# EAGLE design robot (EAGLE 6.5.0)
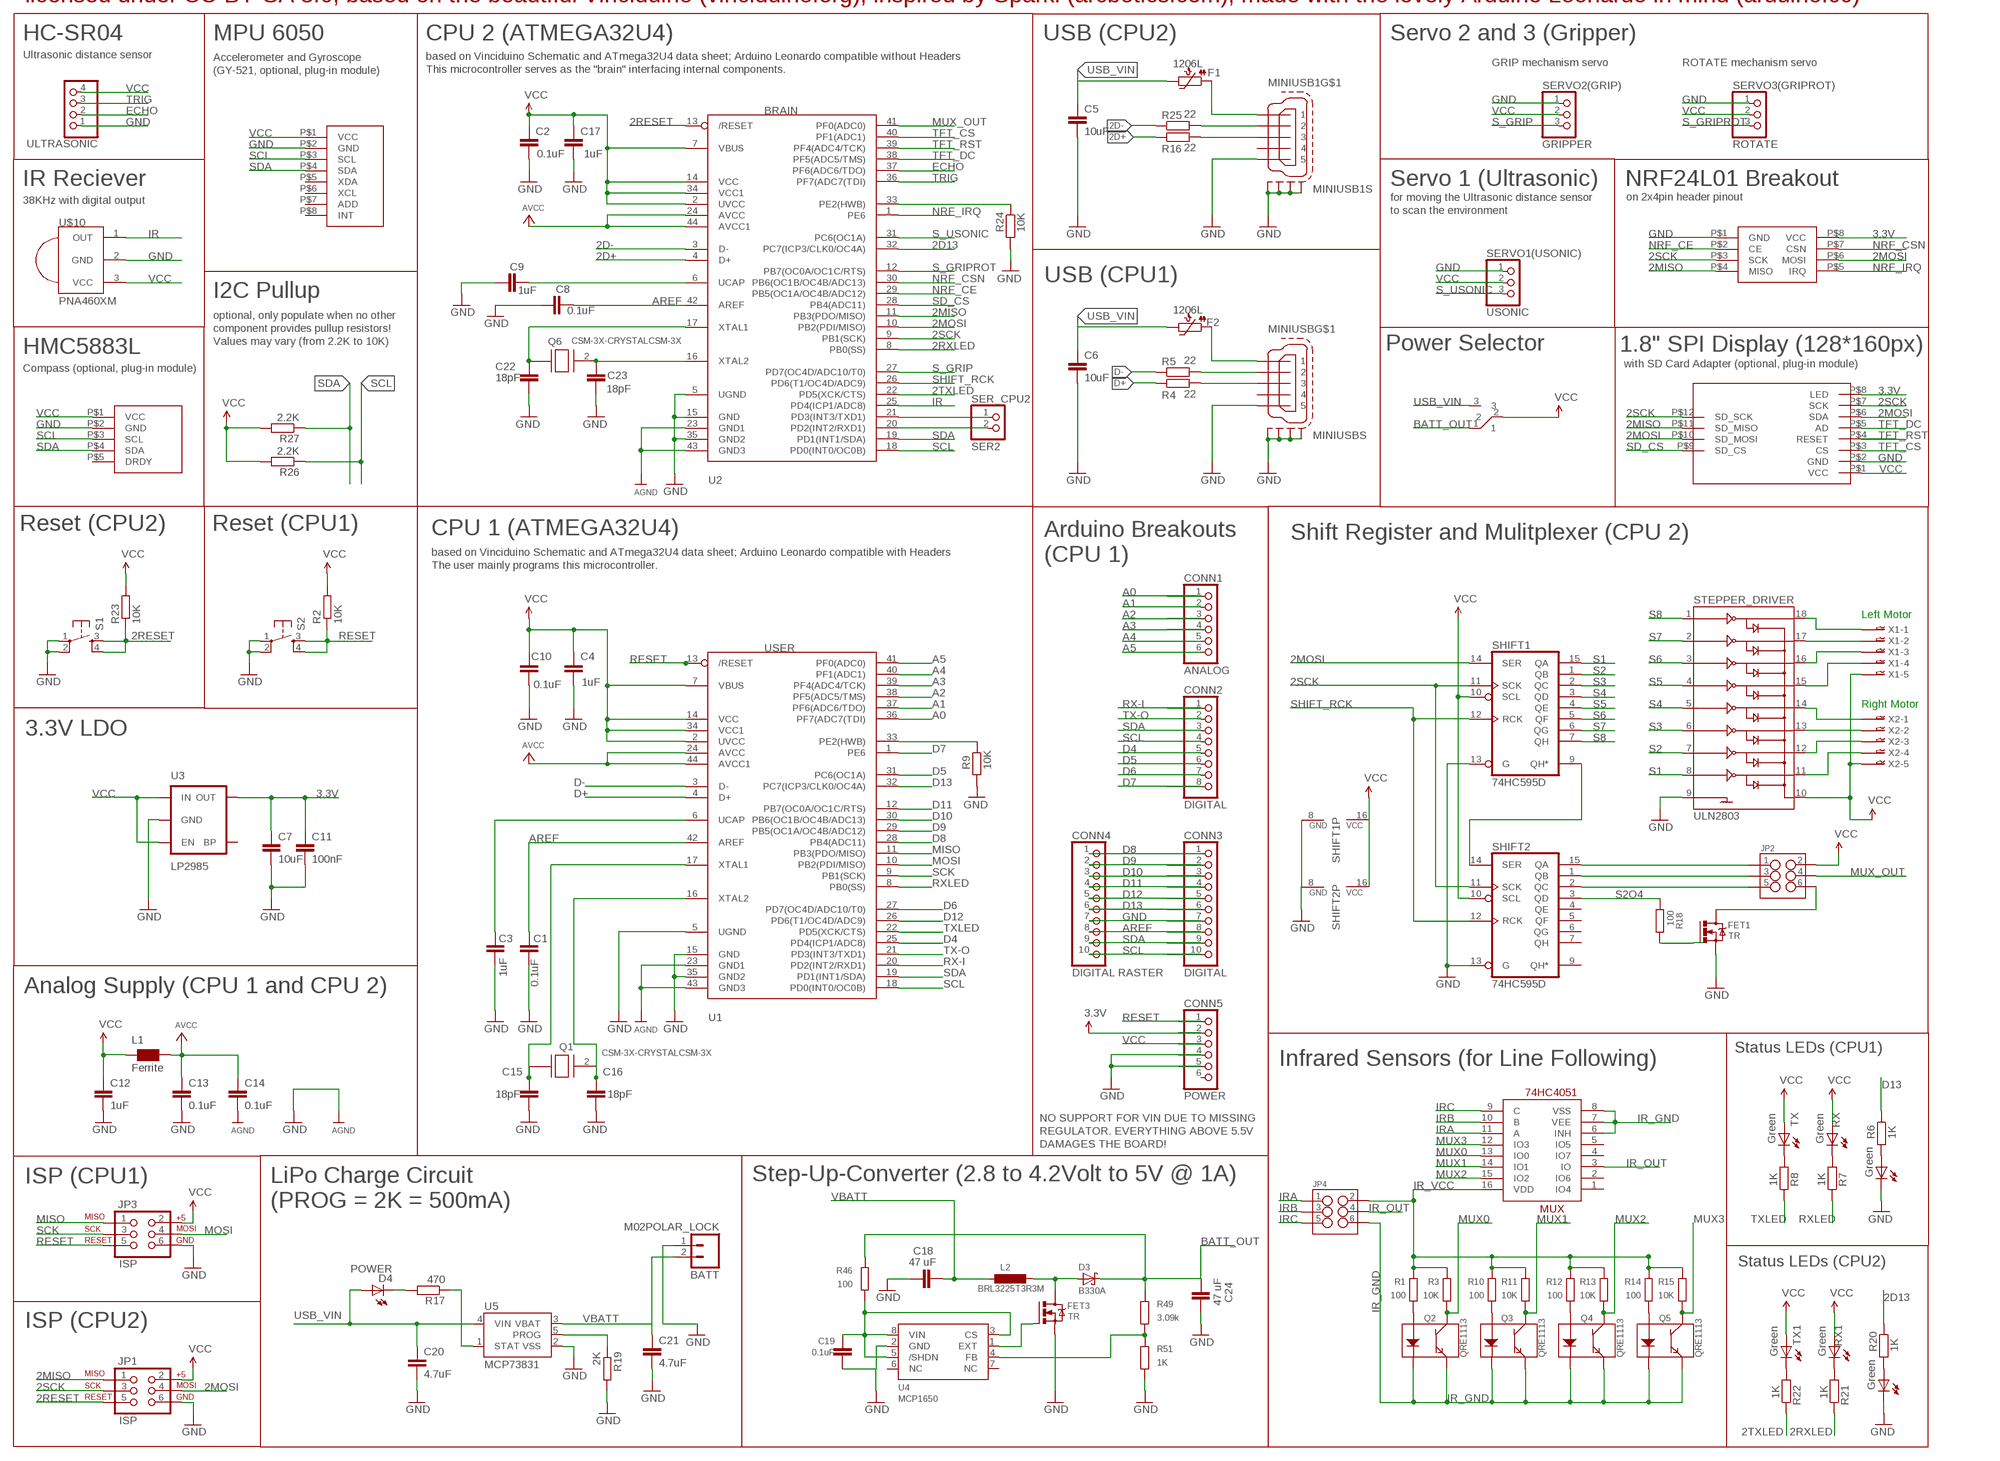
[diagram p0: schematic, sheet 1]

## Parts
BATT  M02POLAR_LOCK  [MOLEX-1X2_LOCK]
C1  0.1uF  C-EUC1206  [C1206]
C2  0.1uF  C-EUC1206  [C1206]
C3  1uF  C-EUC1206  [C1206]
C4  1uF  C-EUC1206  [C1206]
C5  10uF  C-EUC1206  [C1206]
C6  10uF  C-EUC1206  [C1206]
C7  10uF  C-EUC1206  [C1206]
C8  0.1uF  C-EUC1206  [C1206]
C9  1uF  C-EUC1206  [C1206]
C10  0.1uF  C-EUC1206  [C1206]
C11  100nF  C-EUC1206  [C1206]
C12  1uF  C-EUC1206  [C1206]
C13  0.1uF  C-EUC1206  [C1206]
C14  0.1uF  C-EUC1206  [C1206]
C15  18pF  C-EUC1206  [C1206]
C16  18pF  C-EUC1206  [C1206]
C17  1uF  C-EUC1206  [C1206]
C18  47 uF  C-EUC1206  [C1206]
C19  0.1uF  C-EUC1206  [C1206]
C20  4.7uF  C-EUC1206  [C1206]
C21  4.7uF  C-EUC1206  [C1206]
C22  18pF  C-EUC1206  [C1206]
C23  18pF  C-EUC1206  [C1206]
C24  47 uF  C-EUC1206  [C1206]
CONN1  ANALOG  PINHD-1X6B  [1X06-BIG]
CONN2  DIGITAL  PINHD-1X8BIG  [1X08-BIG]
CONN3  DIGITAL  PINHD-1X10  [1X10-BIG]
CONN4  DIGITAL RASTER  PINHD-1X10  [1X10-BIG]
CONN5  POWER  PINHD-1X6B  [1X06-BIG]
D3  B330A  [SMA]
D4  POWER  LED1206  [LED-1206]
D13  Green  LED1206  [LED-1206]
D13_2  Green  LED1206  [LED-1206]
F1  1206L  PTC1206_L  [1206_PTC]
F2  1206L  PTC1206_L  [1206_PTC]
FET1  TR  IRLML2502TR  [MICRO3]
FET3  TR  IRLML2502TR  [MICRO3]
JP1  ISP  AVR_SPI_PRG_6PTH  [2X3]
JP2  M03X22X3_SILK_SM  [2X3]
JP3  ISP  AVR_SPI_PRG_6PTH  [2X3]
JP4  M03X22X3_SILK_SM  [2X3]
L1  Ferrite  WE-CBF_1206W  [1206W]
L2  BRL3225T3R3M  L-EUL3225P  [L3225P]
MINIUSB  MINI-USB-SCHIELD-32005-201  [32005-201]
MINIUSB1  MINI-USB-SCHIELD-32005-201  [32005-201]
MUX  74HC4051  74HC4051_MUX  [SO16]
Q1  CSM-3X-CRYSTALCSM-3X  [CSM-3X]
Q2  QRE1113  [QRE1113]
Q3  QRE1113  [QRE1113]
Q4  QRE1113  [QRE1113]
Q5  QRE1113  [QRE1113]
Q6  CSM-3X-CRYSTALCSM-3X  [CSM-3X]
R1  100  R-EU_R1206  [R1206]
R2  10K  R-EU_R1206  [R1206]
R3  10K  R-EU_R1206  [R1206]
R4  22  R-EU_R1206  [R1206]
R5  22  R-EU_R1206  [R1206]
R6  1K  R-EU_R1206  [R1206]
R7  1K  R-EU_R1206  [R1206]
R8  1K  R-EU_R1206  [R1206]
R9  10K  R-EU_R1206  [R1206]
R10  100  R-EU_R1206  [R1206]
R11  10K  R-EU_R1206  [R1206]
R12  100  R-EU_R1206  [R1206]
R13  10K  R-EU_R1206  [R1206]
R14  100  R-EU_R1206  [R1206]
R15  10K  R-EU_R1206  [R1206]
R16  22  R-EU_R1206  [R1206]
R17  470  R-EU_R1206  [R1206]
R18  100  R-EU_R1206  [R1206]
R19  2K  R-EU_R1206  [R1206]
R20  1K  R-EU_R1206  [R1206]
R21  1K  R-EU_R1206  [R1206]
R22  1K  R-EU_R1206  [R1206]
R23  10K  R-EU_R1206  [R1206]
R24  10K  R-EU_R1206  [R1206]
R25  22  R-EU_R1206  [R1206]
R26  2.2K  R-EU_R1206  [R1206]
R27  2.2K  R-EU_R1206  [R1206]
R46  100  R-EU_R1206  [R1206]
R49  3.09k  R-EU_R1206  [R1206]
R51  1K  R-EU_R1206  [R1206]
RX  Green  LED1206  [LED-1206]
RX1  Green  LED1206  [LED-1206]
S1  Reset  TAC_SWITCHSMD  [TACTILE_SWITCH_SMD]
S2  Reset  TAC_SWITCHSMD  [TACTILE_SWITCH_SMD]
SER_CPU2  SER2  PINHD-1X2  [1X02]
SERVO1(USONIC)  USONIC  PINHD-1X3  [1X03]
SERVO2(GRIP)  GRIPPER  PINHD-1X3  [1X03]
SERVO3(GRIPROT)  ROTATE  PINHD-1X3  [1X03]
SHIFT1  74HC595D  [SO16]
SHIFT2  74HC595D  [SO16]
STEPPER_DRIVER  ULN2803  ULN2803SOICW  [SO18L]
SW1  SPDT  [SPDT-PTH]
TX  Green  LED1206  [LED-1206]
TX1  Green  LED1206  [LED-1206]
U1  USER  ATMEGA32U4-AU  [TQFP44]
U2  BRAIN  ATMEGA32U4-AU  [TQFP44]
U3  LP2985  V_REG_LDOSMD  [SOT23-5@1]
U4  MCP1650  [MSOP8]
U5  MCP73831  MCP73831SMD  [SOT23-5]
U$2  1.8TFT+SD  [1.8TFTSD]
U$3  GY-521  [GY-521]
U$4  HMC5883L  [HMC5883L]
U$5  NRF24L01+  [NRF24L01+]
U$10  PNA460XM  [PNA460XM]
ULTRASONIC  PINHD-1X4  [1X04]
X1  05-JST-B5B-XH-A  [B5B-XH]
X2  05-JST-B5B-XH-A  [B5B-XH]

## Nets
2D13: R20.1 U2.32(PC7(ICP3/CLK0/OC4A))
2D+: R16.1 U2.4(D+)
2D-: R25.1 U2.3(D-)
2MISO: JP1.1 U2.11(PB3(PDO/MISO)) U$2.P$11(SD_MISO) U$5.P$4(MISO)
2MOSI: JP1.4 SHIFT1.14(SER) U2.10(PB2(PDI/MISO)) U$2.P$6(SDA) U$2.P$10(SD_MOSI) U$5.P$6(MOSI)
2RESET: JP1.5 R23.1 S1.3 S1.4 U2.13(/RESET)
2RXLED: R21.1 U2.8(PB0(SS))
2SCK: JP1.3 SHIFT1.11(SCK) SHIFT2.11(SCK) U2.9(PB1(SCK)) U$2.P$7(SCK) U$2.P$12(SD_SCK) U$5.P$3(SCK)
2TXLED: R22.1 U2.22(PD5(XCK/CTS))
2XTAL1: C22.1 Q6.1 U2.17(XTAL1)
2XTAL2: C23.1 Q6.2 U2.16(XTAL2)
3.3V: C7.1 C11.1 CONN5.2 U3.5(OUT) U$2.P$8(LED) U$5.P$8(VCC)
A0: CONN1.1 U1.36(PF7(ADC7(TDI))
A1: CONN1.2 U1.37(PF6(ADC6/TDO))
A2: CONN1.3 U1.38(PF5(ADC5/TMS))
A3: CONN1.4 U1.39(PF4(ADC4/TCK))
A4: CONN1.5 U1.40(PF1(ADC1))
A5: CONN1.6 U1.41(PF0(ADC0))
AREF: C1.2 C8.2 CONN3.8 CONN4.8 U1.42(AREF) U2.42(AREF)
AVCC: C13.1 C14.1 L1.2 U1.24(AVCC) U1.44(AVCC1) U2.24(AVCC) U2.44(AVCC1)
BATT_OUT: C24.1 D3.C R46.2 R49.2 SW1.1
D4: CONN2.5 U1.25(PD4(ICP1/ADC8))
D5: CONN2.6 U1.31(PC6(OC1A))
D6: CONN2.7 U1.27(PD7(OC4D/ADC10/T0))
D7: CONN2.8 U1.1(PE6)
D8: CONN3.1 CONN4.1 U1.28(PB4(ADC11))
D9: CONN3.2 CONN4.2 U1.29(PB5(OC1A/OC4B/ADC12))
D10: CONN3.3 CONN4.3 U1.30(PB6(OC1B/OC4B/ADC13))
D11: CONN3.4 CONN4.4 U1.12(PB7(OC0A/OC1C/RTS))
D12: CONN3.5 CONN4.5 U1.26(PD6(T1/OC4D/ADC9))
D13: CONN3.6 CONN4.6 R6.1 U1.32(PC7(ICP3/CLK0/OC4A))
D+: R4.1 U1.4(D+)
D-: R5.1 U1.3(D-)
ECHO: U2.37(PF6(ADC6/TDO)) ULTRASONIC.2
GND: BATT.1 C1.1 C2.2 C3.2 C4.2 C5.2 C6.2 C7.2 C8.1 C9.2 C10.2 C11.2 C12.2 C13.2 C14.2 C15.2 C16.2 C17.2 C18.1 C19.2 C20.2 C21.2 C22.2 C23.2 C24.2 CONN3.7 CONN4.7 CONN5.4 CONN5.5 D13.C D13_2.C FET1.2(S) FET3.2(S) JP1.6 JP3.6 MINIUSB1.5 MINIUSB1.M1(S:S1) MINIUSB1.M2(S:S2) MINIUSB1.M3(S:S3) MINIUSB1.M4(S:S4) MINIUSB.5 MINIUSB.M1(S:S1) MINIUSB.M2(S:S2) MINIUSB.M3(S:S3) MINIUSB.M4(S:S4) R9.2 R19.2 R24.2 R51.1 S1.1 S1.2 S2.1 S2.2 SERVO1(USONIC).1 SERVO2(GRIP).1 SERVO3(GRIPROT).1 SHIFT1.8(GND) SHIFT1.13(G) SHIFT2.8(GND) SHIFT2.13(G) STEPPER_DRIVER.9 U1.5(UGND) U1.15(GND) U1.23(GND1) U1.35(GND2) U1.43(GND3) U2.5(UGND) U2.15(GND) U2.23(GND1) U2.35(GND2) U2.43(GND3) U3.2(GND) U4.2(GND) U5.2(VSS) U$2.P$2(GND) U$3.P$2(GND) U$4.P$2(GND) U$5.P$1(GND) U$10.2(GND) ULTRASONIC.1 ; supply symbol labelled AGND
IR: U2.25(PD4(ICP1/ADC8)) U$10.1(OUT)
IR_GND: JP4.6 MUX.6(INH) MUX.7(VEE) MUX.8(VSS) Q2.2(K) Q2.4(E) Q3.2(K) Q3.4(E) Q4.2(K) Q4.4(E) Q5.2(K) Q5.4(E)
IR_OUT: JP4.4 MUX.3(IO)
IR_VCC: JP4.2 MUX.16(VDD) R1.2 R3.2 R10.2 R11.2 R12.2 R13.2 R14.2 R15.2
IRA: JP4.1 MUX.11(A)
IRB: JP4.3 MUX.10(B)
IRC: JP4.5 MUX.9(C)
MISO: JP3.1 U1.11(PB3(PDO/MISO))
MOSI: JP3.4 U1.10(PB2(PDI/MISO))
MUX0: MUX.13(IO0) Q2.3(C) R3.1
MUX1: MUX.14(IO1) Q3.3(C) R11.1
MUX2: MUX.15(IO2) Q4.3(C) R13.1
MUX3: MUX.12(IO3) Q5.3(C) R15.1
MUX_OUT: JP2.4 U2.41(PF0(ADC0))
N$1: R8.2 TX.C
N$2: MINIUSB.2 R5.2
N$3: SER_CPU2.1 U2.21(PD3(INT3/TXD1))
N$4: SER_CPU2.2 U2.20(PD2(INT2/RXD1))
N$5: MINIUSB.3 R4.2
N$6: R9.1 U1.33(PE2(HWB))
N$7: D13.A R6.2
N$8: C9.1 U2.6(UCAP)
N$9: R7.2 RX.C
N$10: Q2.1(A) R1.1
N$11: Q3.1(A) R10.1
N$12: Q4.1(A) R12.1
N$13: F2.1 MINIUSB.1
N$14: Q5.1(A) R14.1
N$15: C3.1 U1.6(UCAP)
N$16: FET1.1(G) R18.2
N$17: R24.1 U2.33(PE2(HWB))
N$18: F1.1 MINIUSB1.1
N$19: FET3.1(G) U4.1(EXT)
N$20: R19.1 U5.5(PROG)
N$21: R17.1 U5.1(STAT)
N$22: D4.C R17.2
N$23: R49.1 R51.2 U4.4(FB)
N$24: D3.A FET3.3(D) L2.2
N$25: C19.1 R46.1 U4.3(CS) U4.5(/SHDN) U4.8(VIN)
N$26: STEPPER_DRIVER.11 X2.P$4
N$27: STEPPER_DRIVER.12 X2.P$3
N$28: STEPPER_DRIVER.13 X2.P$2
N$29: STEPPER_DRIVER.14 X2.P$1
N$30: STEPPER_DRIVER.15 X1.P$4
N$31: STEPPER_DRIVER.16 X1.P$3
N$32: STEPPER_DRIVER.17 X1.P$2
N$33: STEPPER_DRIVER.18 X1.P$1
N$34: D13_2.A R20.2
N$35: R22.2 TX1.C
N$36: R21.2 RX1.C
N$37: MINIUSB1.2 R25.2
N$38: MINIUSB1.3 R16.2
N$41: JP2.1 SHIFT2.15(QA)
N$42: JP2.3 SHIFT2.1(QB)
N$43: JP2.5 SHIFT2.2(QC)
N$45: FET1.3(D) JP2.6
NRF_CE: U2.29(PB5(OC1A/OC4B/ADC12)) U$5.P$2(CE)
NRF_CSN: U2.30(PB6(OC1B/OC4B/ADC13)) U$5.P$7(CSN)
NRF_IRQ: U2.1(PE6) U$5.P$5(IRQ)
RESET: CONN5.1 JP3.5 R2.1 S2.3 S2.4 U1.13(/RESET)
RX-I: CONN2.1 U1.20(PD2(INT2/RXD1))
RXLED: R7.1 U1.8(PB0(SS))
S1: SHIFT1.15(QA) STEPPER_DRIVER.8
S1OVERFLOW: SHIFT1.9(QH*) SHIFT2.14(SER)
S2: SHIFT1.1(QB) STEPPER_DRIVER.7
S2O4: R18.1 SHIFT2.3(QD)
S3: SHIFT1.2(QC) STEPPER_DRIVER.6
S4: SHIFT1.3(QD) STEPPER_DRIVER.5
S5: SHIFT1.4(QE) STEPPER_DRIVER.4
S6: SHIFT1.5(QF) STEPPER_DRIVER.3
S7: SHIFT1.6(QG) STEPPER_DRIVER.2
S8: SHIFT1.7(QH) STEPPER_DRIVER.1
S_GRIP: SERVO2(GRIP).3 U2.27(PD7(OC4D/ADC10/T0))
S_GRIPROT: SERVO3(GRIPROT).3 U2.12(PB7(OC0A/OC1C/RTS))
S_USONIC: SERVO1(USONIC).3 U2.31(PC6(OC1A))
SCK: JP3.3 U1.9(PB1(SCK))
SCL: CONN2.4 CONN3.10 CONN4.10 R26.1 U1.18(PD0(INT0/OC0B)) U2.18(PD0(INT0/OC0B)) U$3.P$3(SCL) U$4.P$3(SCL)
SD_CS: U2.28(PB4(ADC11)) U$2.P$9(SD_CS)
SDA: CONN2.3 CONN3.9 CONN4.9 R27.1 U1.19(PD1(INT1/SDA)) U2.19(PD1(INT1/SDA)) U$3.P$4(SDA) U$4.P$4(SDA)
SHIFT_RCK: SHIFT1.12(RCK) SHIFT2.12(RCK) U2.26(PD6(T1/OC4D/ADC9))
TFT_CS: U2.40(PF1(ADC1)) U$2.P$3(CS)
TFT_DC: U2.38(PF5(ADC5/TMS)) U$2.P$5(AD)
TFT_RST: U2.39(PF4(ADC4/TCK)) U$2.P$4(RESET)
TRIG: U2.36(PF7(ADC7(TDI)) ULTRASONIC.3
TX-O: CONN2.2 U1.21(PD3(INT3/TXD1))
TXLED: R8.1 U1.22(PD5(XCK/CTS))
USB_VIN: C5.1 C6.1 C20.1 D4.A F1.2 F2.2 SW1.3 U5.4(VIN)
VBATT: BATT.2 C18.2 C21.1 L2.1 U5.3(VBAT)
VCC: C2.1 C4.1 C10.1 C12.1 C17.1 CONN5.3 JP1.2 JP2.2 JP3.2 L1.1 R2.2 R23.2 R26.2 R27.2 RX1.A RX.A SERVO1(USONIC).2 SERVO2(GRIP).2 SERVO3(GRIPROT).2 SHIFT1.10(SCL) SHIFT1.16(VCC) SHIFT2.10(SCL) SHIFT2.16(VCC) STEPPER_DRIVER.10 SW1.2 TX1.A TX.A U1.2(UVCC) U1.7(VBUS) U1.14(VCC) U1.34(VCC1) U2.2(UVCC) U2.7(VBUS) U2.14(VCC) U2.34(VCC1) U3.1(IN) U3.3(EN) U$2.P$1(VCC) U$3.P$1(VCC) U$4.P$1(VCC) U$10.3(VCC) ULTRASONIC.4 X1.P$5 X2.P$5
XTAL1: C15.1 Q1.1 U1.17(XTAL1)
XTAL2: C16.1 Q1.2 U1.16(XTAL2)
Unconnected: CONN5.6 MINIUSB1.4 MINIUSB.4 MUX.1(IO4) MUX.2(IO6) MUX.4(IO7) MUX.5(IO5) SHIFT2.4(QE) SHIFT2.5(QF) SHIFT2.6(QG) SHIFT2.7(QH) SHIFT2.9(QH*) U3.4(BP) U4.6(NC) U4.7(NC) U$3.P$5(XDA) U$3.P$6(XCL) U$3.P$7(ADD) U$3.P$8(INT) U$4.P$5(DRDY)

## Notes on the sheet
- Edubot V.0.12 by Sebastian Muszytowski <muzy@muzy.eu>
- licensed under CC-BY-SA 3.0, based on the beautiful Vinciduino (vinciduino.org), inspired by Sparki (arcbotics.com), made with the lovely Arduino Leonardo in mind (arduino.cc)
- HC-SR04 | MPU 6050 | CPU 2 (ATMEGA32U4) | USB (CPU2) | Servo 2 and 3 (Gripper)
- Ultrasonic distance sensor
- GRIP mechanism servo | ROTATE mechanism servo
- based on Vinciduino Schematic and ATmega32U4 data sheet; Arduino Leonardo compatible without Headers
  This microcontroller serves as the "brain" interfacing internal components.
- Accelerometer and Gyroscope 
  (GY-521, optional, plug-in module)
- IR Reciever | Servo 1 (Ultrasonic) | NRF24L01 Breakout
- on 2x4pin header pinout
- 38KHz with digital output
- for moving the Ultrasonic distance sensor
  to scan the environment
- USB (CPU1)
- I2C Pullup
- optional, only populate when no other
  component provides pullup resistors!
  Values may vary (from 2.2K to 10K)
- HMC5883L | Power Selector | 1.8" SPI Display (128*160px)
- with SD Card Adapter (optional, plug-in module)
- Compass (optional, plug-in module)
- Reset (CPU2) | Reset (CPU1) | CPU 1 (ATMEGA32U4)
- Shift Register and Mulitplexer (CPU 2)
- Arduino Breakouts
  (CPU 1)
- based on Vinciduino Schematic and ATmega32U4 data sheet; Arduino Leonardo compatible with Headers
  The user mainly programs this microcontroller.
- Left Motor
- Right Motor
- 3.3V LDO
- Analog Supply (CPU 1 and CPU 2)
- Status LEDs (CPU1)
- Infrared Sensors (for Line Following)
- NO SUPPORT FOR VIN DUE TO MISSING
  REGULATOR. EVERYTHING ABOVE 5.5V
  DAMAGES THE BOARD!
- ISP (CPU1) | Step-Up-Converter (2.8 to 4.2Volt to 5V @ 1A)
- LiPo Charge Circuit
  (PROG = 2K = 500mA)
- Status LEDs (CPU2)
- ISP (CPU2)

## Library data of the parts
BATT = SparkFun-Connectors:M02: Standard 2-pin 0.1" header. Use with - straight break away headers ( PRT-00116) - right angle break away headers (PRT-00553) - swiss pins (PRT-00743) - machine pins (PRT-00117) - female headers (PRT-00115) Molex polarized connector foot print use with: PRT-08233 with associated crimp pins and housings. 2.54_SCREWTERM for use with PRT-10571. 3.5mm Screw Terminal footprints for PRT-08084 5mm Screw Terminal footprints for use with PRT-08433
C1-C24 = resistor:C-EU: CAPACITOR, European symbol
CONN1 CONN5 = adafruit:PINHD-1X6: PIN HEADER
CONN2 = adafruit:PINHD-1X8: PIN HEADER
CONN3 CONN4 = adafruit:PINHD-1X10: Pin header 1x10 0.1" spacing With round pins
D3 = aaron_discrete:B330A: SCHOTTKY DIODE
D4 D13 D13_2 RX RX1 TX TX1 = SparkFun-LED:LED: LEDs Standard schematic elements and footprints for 5mm, 3mm, 1206, and 0603 sized LEDs. 5mm - Spark Fun Electronics SKU : COM-00529 (and others)
F1 F2 = microbuilder:PTC: PTC (Resettable Fuse) 1206 Package 250mA PTC (16V Max, Time-to-Trip: 0.08s) - Digikey: F2110CT-ND 1210 Package 100mA PTC (30V Max, Time-to-Trip: 0.6s) - Digikey: MF-USMF010-2CT-ND 1812 Package 750mA PTC (24V Max, Time-to-Trip: 0.2s) - Digikey: MF-MSMF075/24-2CT-ND
FET1 FET3 = aaron_discrete:IRLML2502TR
JP1 JP3 = SparkFun:AVR_SPI_PRG_6: AVR ISP 6 Pin This is the reduced ISP connector for AVR programming. Common on Arduino. This footprint will take up less PCB space and can be used with a 10-pin to 6-pin adapter such as SKU: BOB-08508
JP2 JP4 = SparkFun-Connectors:M03X2: 2x3 .1" header. Shrouded, with keying- CONN-10681 SMT- CONN-11415 Pogo pins- HW-11044
L1 = wuerth-elektronik:WE-CBF: SMD EMI Suppression Ferrite Beads - excellent anti-EMI properties - low DCR - impedances till 3000 ohms - rated current up to 6 A
L2 = resistor:L-EU: INDUCTOR, European symbol
MINIUSB MINIUSB1 = con-cypressindustries:MINI-USB-SCHIELD-: MINI USB-B Conector Source: www.cypressindustries.com; OC_FARNELL: unknown; OC_NEWARK: unknown
MUX = SparkFun-AnalogIC:74HC4051_MUX: 8:1 analog mux
Q1 Q6 = fmc:CSM-3X-CRYSTAL
Q2-Q5 = aaron_discrete:QRE1113: Surface-mount IR reflective sensor - 5mm range
R1-R27 R46 R49 R51 = resistor:R-EU_: RESISTOR, European symbol
S1 S2 = SparkFun:TAC_SWITCH: Momentary Switch Button commonly used for reset or general input. Spark Fun Electronics SKU : COM-00097
SER_CPU2 = pinhead:PINHD-1X2: PIN HEADER
SERVO1(USONIC) SERVO2(GRIP) SERVO3(GRIPROT) = pinhead:PINHD-1X3: PIN HEADER
SHIFT1 SHIFT2 = 74xx-eu:74*595: 8-bit SHIFT REGISTER, output latch
STEPPER_DRIVER = SparkFun-PowerIC:ULN2803: Darlington Driver ULN2803 Darlington array. 500mA max per channel, 8-channel package. Spark Fun Electronics SKU : COM-00312
SW1 = switch:SPDT
U1 U2 = adafruit:ATMEGA32U4: http://www.ladyada.net/library/eagle
U3 = SparkFun:V_REG_LDO: Voltage Regulator LDO Standard 150mA LDO voltage regulator in SOT-23 layout. Micrel part MIC5205. BP (by-pass) pin is used to lower output noise with 470pF cap.
U4 = aaron_ic:MCP1650: IC CONTROLLER BOOST 2.55V 8MSOP
U5 = SparkFun:MCP73831
U$2 = muzy_robot:1.8TFT+SD: 1.8" FT + SD Card Reader
U$3 = muzy_robot:GY-521: GY-521 Accelerometer and Gyroscope
U$4 = muzy_robot:HMC5883L: HMC5883L compass module
U$5 = muzy_robot:NRF24L01+: NRF24L01+ module
U$10 = adafruit:PNA460XM: IR 38KHz receiver PNA4602 and related receivers http://www.ladyada.net/library/pcb/eaglelibrary.html
ULTRASONIC = pinhead:PINHD-1X4: PIN HEADER
X1 X2 = con-jst-xh:05-JST: JST CONNECTOR

## Net classes
1 vcc: width 0.254 mm

## Board
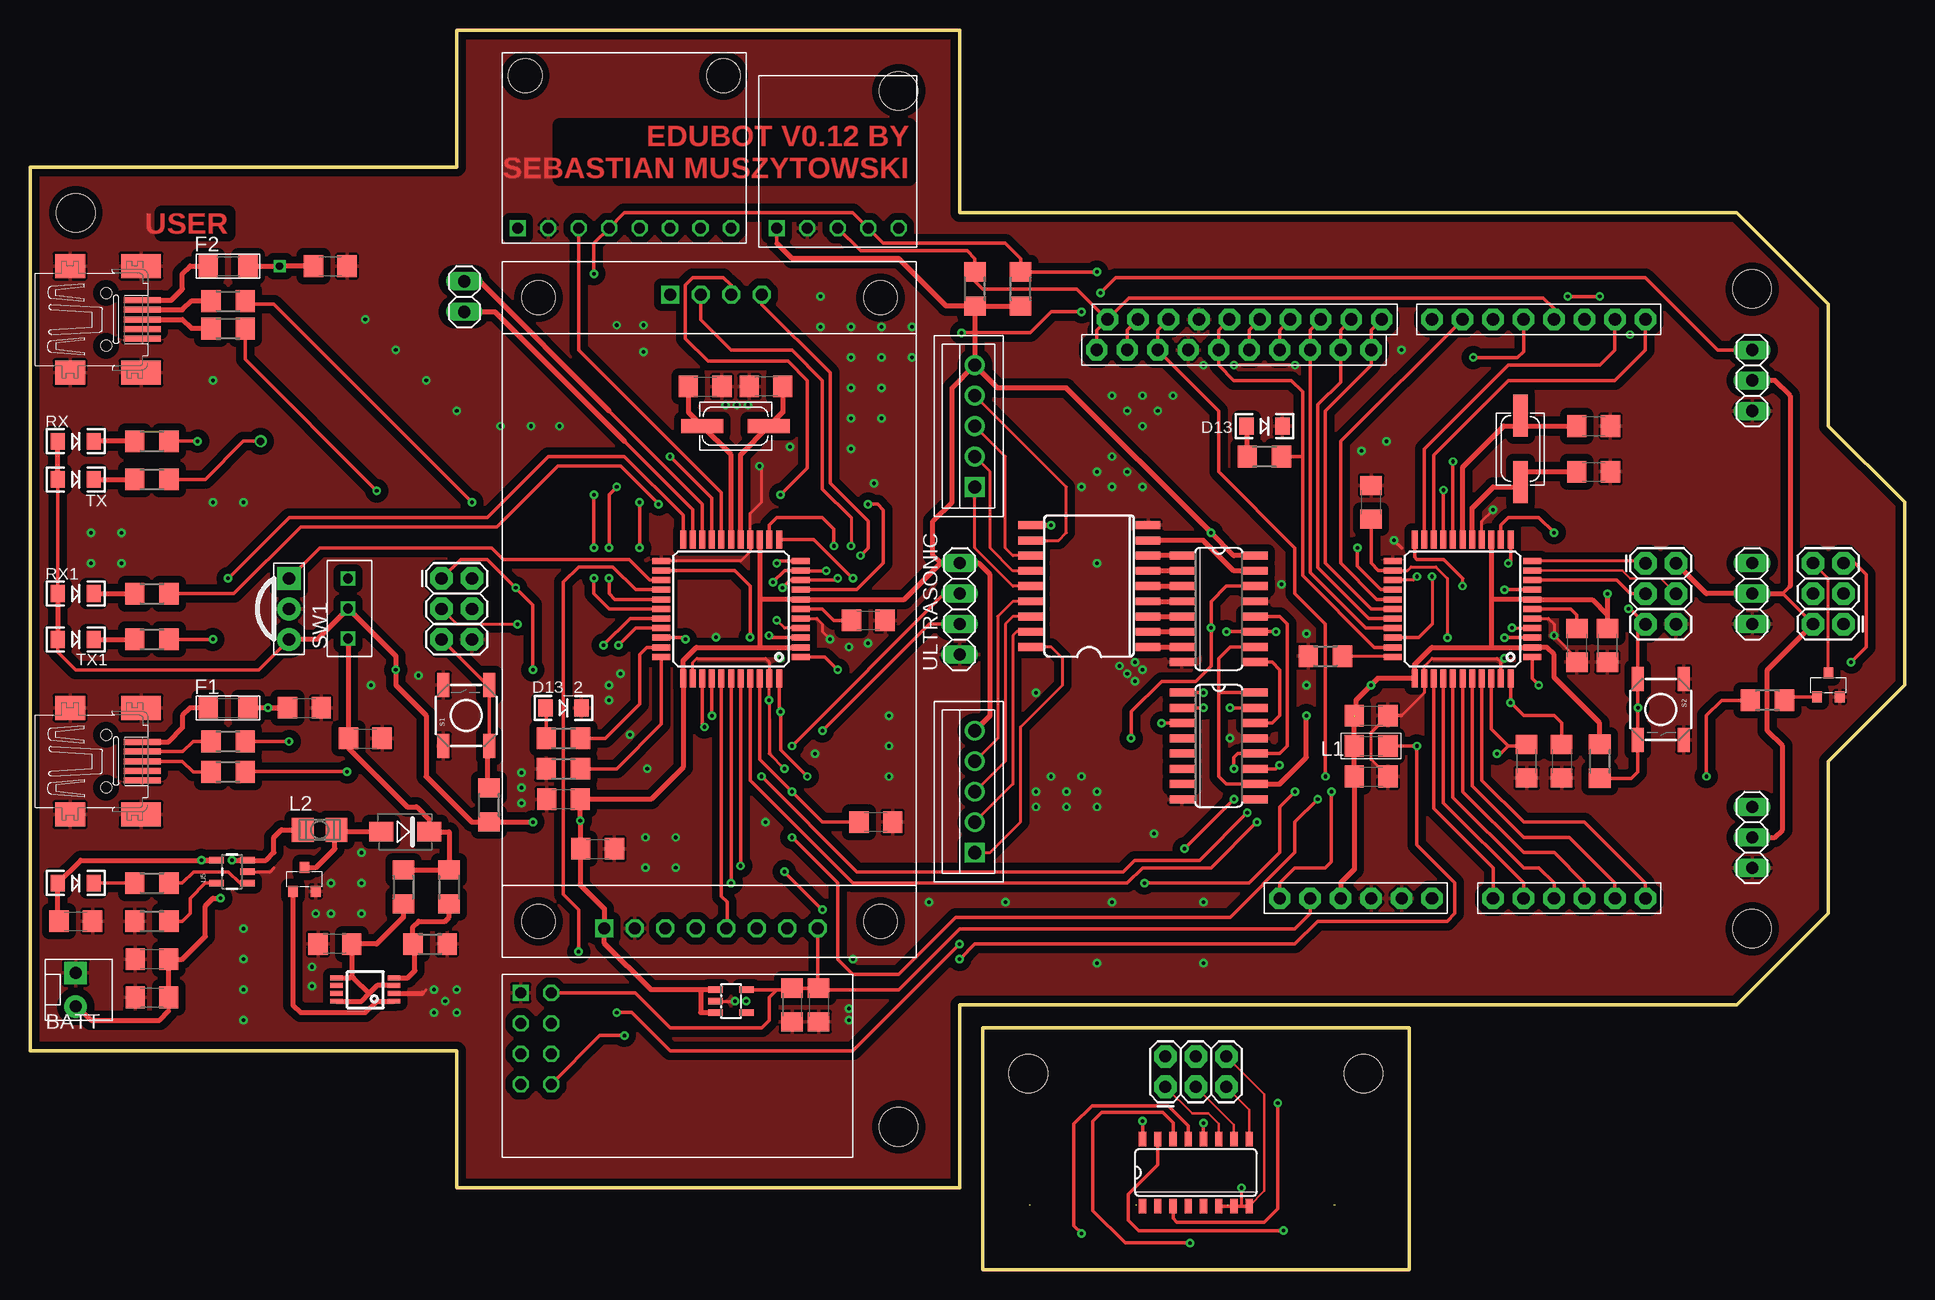
[diagram p1: board, top side]
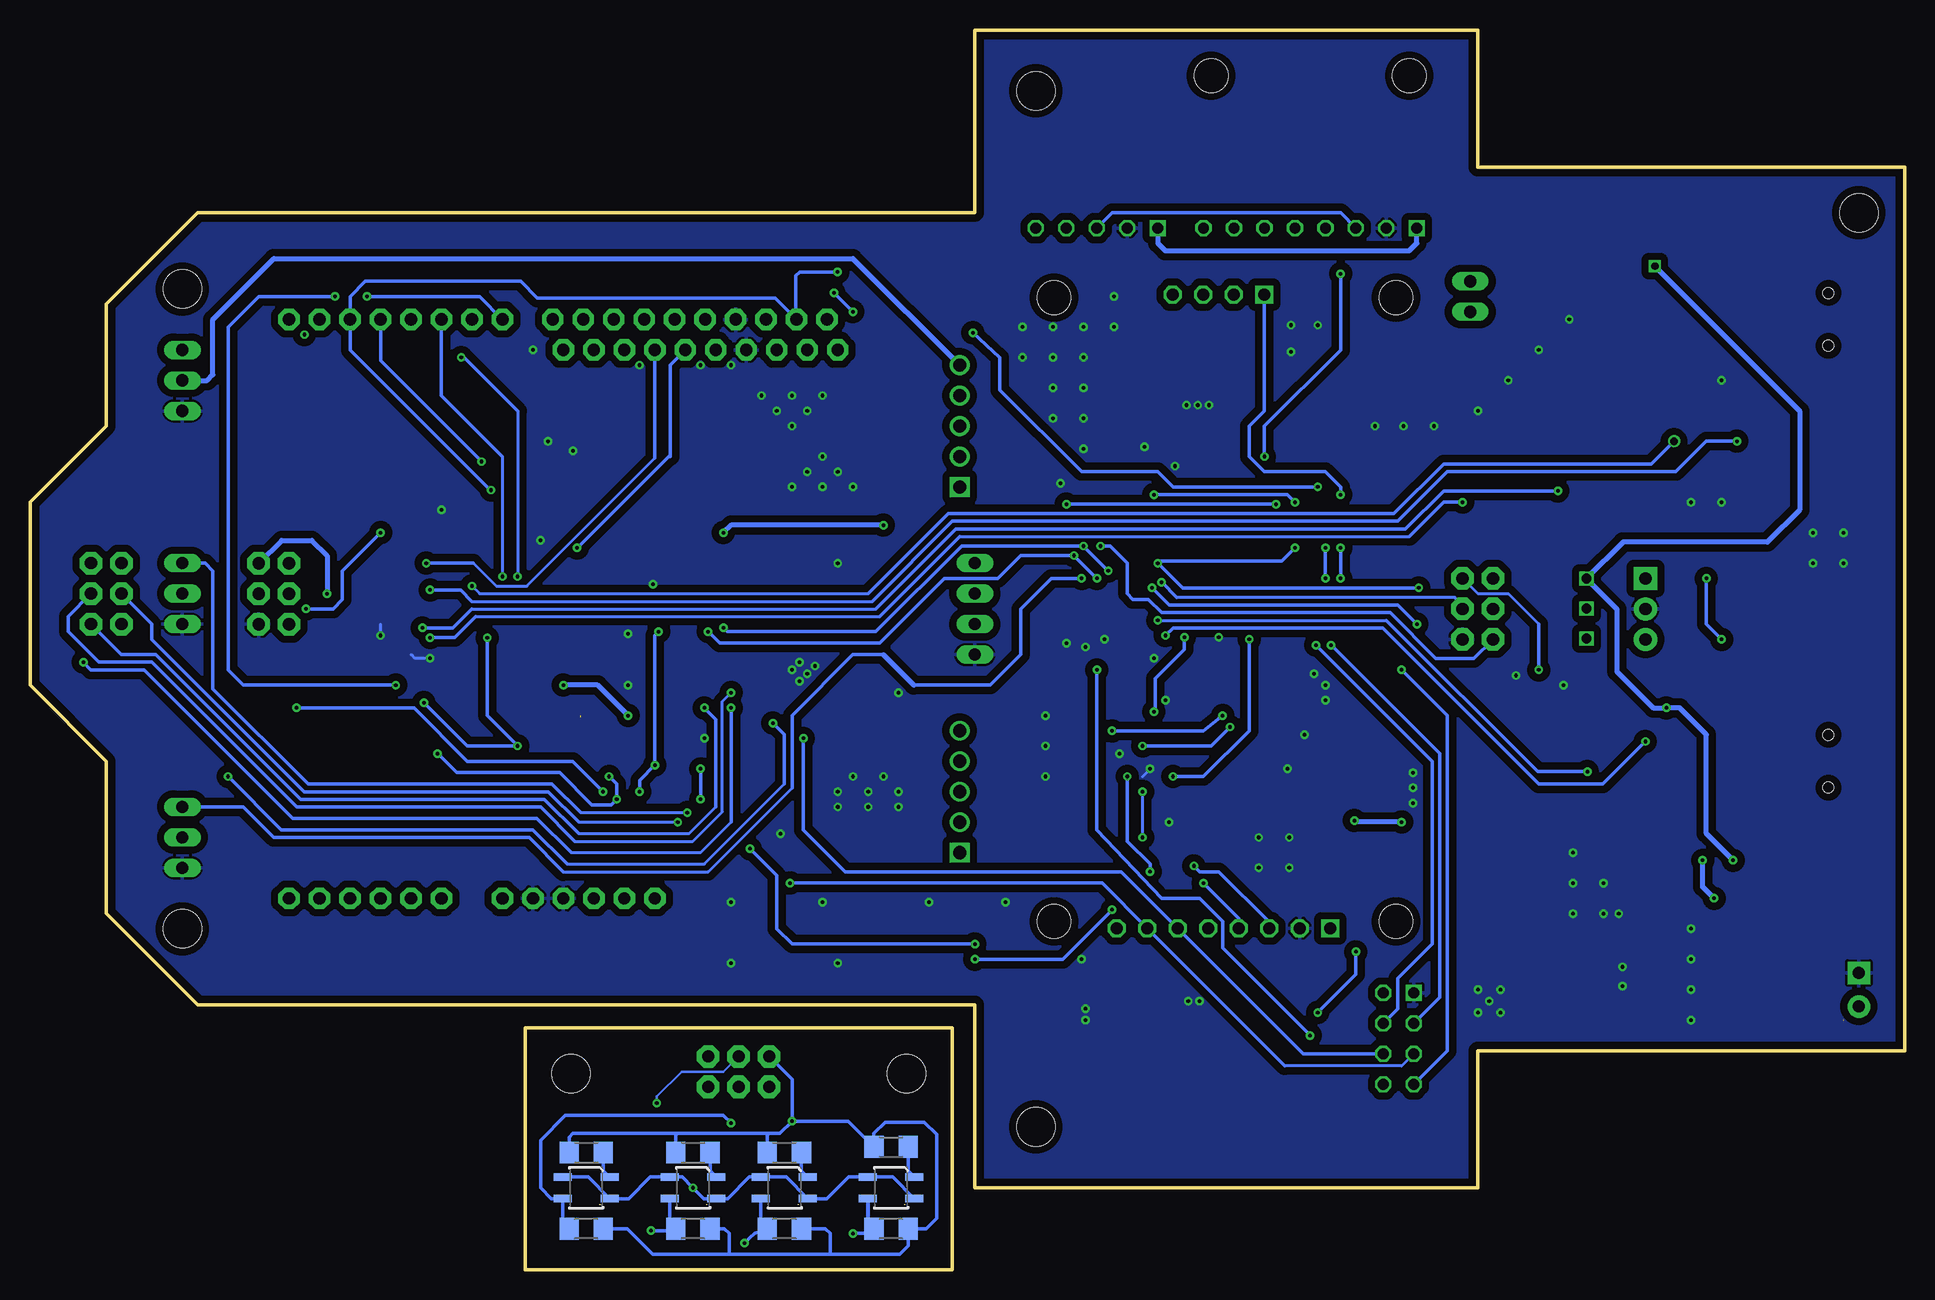
[diagram p2: board, bottom side, seen from below]

Size 156.21 x 103.35 mm. Coordinates in mm from the lower left corner, seen from the top.
Outline: 79.38,20.16 114.94,20.16 114.94,0 79.38,0 79.38,20.16
Outline: 156.21,48.74 149.86,42.39 149.86,29.69 142.24,22.07 77.47,22.07 77.47,6.83 35.56,6.83 35.56,18.26 0,18.26 0,91.92 35.56,91.92 35.56,103.35 77.47,103.35 77.47,88.11 142.24,88.11 149.86,80.49 149.86,70.33 156.21,63.98 156.21,48.74
Copper layers (1*16): Top 0.035mm / dielectric 1.5mm / Bottom 0.035mm
Design rules "pcb-devboards_35µmCU_200µm_Strukturen_Abstaende": minimum track width 0.2mm, minimum drill 0.3mm, track to track 0.2mm, track to pad 0.2mm, pad to pad 0.2mm, via to via 0.2mm, smd to smd 0.2mm, copper to edge 0.4mm, drill to drill 0.4mm, minimum pad ring 0.2mm, minimum via ring 0.2mm, stop-mask expansion 4mil, vias tented up to drill 0mil, thermal gap 0.2mm
Holes 3.2 mm at 83.19,16.35 111.12,16.35 72.39,11.91 72.39,98.27 143.51,81.76 143.51,28.42 3.81,88.11

### Footprints (pad centres in the part's own frame; a part is rotated, then mirrored left to right if it is on the bottom)
MOLEX-1X2_LOCK = drill 1.016 pad 1.88 square: 1 -0.127,0 | drill 1.016 pad 1.88: 2 2.667,0
C1206 = smd 1.6 x 1.8: 1 -1.4,0; 2 1.4,0
1X06-BIG = drill 1.016 pad 1.778 octagon: 1 -6.35,0; 2 -3.81,0; 3 -1.27,0; 4 1.27,0; 5 3.81,0; 6 6.35,0
1X08-BIG = drill 1.016 pad 1.778 octagon: 1 -8.89,0; 2 -6.35,0; 3 -3.81,0; 4 -1.27,0; 5 1.27,0; 6 3.81,0; 7 6.35,0; 8 8.89,0
1X10-BIG = drill 1.016 pad 1.778 octagon: 1 -11.43,0; 2 -8.89,0; 3 -6.35,0; 4 -3.81,0; 5 -1.27,0; 6 1.27,0; 7 3.81,0; 8 6.35,0; 9 8.89,0; 10 11.43,0
SMA = smd 2 x 1.65: A 5,0.8; C 1,0.8
LED-1206 = smd 1.2 x 1.4: A -1.5,0; C 1.5,0
1206_PTC = smd 1.6 x 1.8: 1 -1.654,0; 2 1.654,0
MICRO3 = smd 0.8 x 0.9: 1 -0.95,-1; 2 0.95,-1; 3 0,1
2X3 = drill 1.016 pad 1.88 octagon: 1 0,0; 2 0,2.54; 3 2.54,0; 4 2.54,2.54; 5 5.08,0; 6 5.08,2.54
1206W = smd 1.6 x 1.8: 1 -1.4,0; 2 1.4,0
L3225P = smd 1.8 x 2: 1 -1.4,0; 2 1.4,0
32005-201 = smd 3.1 x 0.5: 1 3,1.6; 2 3,0.8; 3 3,0; 4 3,-0.8; 5 3,-1.6 | smd 2.5 x 2: M1 -3,-4.45; M2 -3,4.45 | smd 3.3 x 2: M3 2.9,4.45; M4 2.9,-4.45 | hole 0.9: 0,2.2; 0,-2.2
SO16 = smd 0.6 x 1.2: 1 -4.445,-2.8; 2 -3.175,-2.8; 3 -1.905,-2.8; 4 -0.635,-2.8; 5 0.635,-2.8; 6 1.905,-2.8; 7 3.175,-2.8; 8 4.445,-2.8; 9 4.445,2.8; 10 3.175,2.8; 11 1.905,2.8; 12 0.635,2.8; 13 -0.635,2.8; 14 -1.905,2.8; 15 -3.175,2.8; 16 -4.445,2.8
CSM-3X = smd 3.5 x 1.2: 1 2.775,0; 2 -2.775,0
QRE1113 = smd 1.5 x 0.6: 1 -1.95,-0.9; 2 1.95,-0.9; 3 1.95,0.9; 4 -1.95,0.9
R1206 = smd 1.6 x 1.803: 1 -1.422,0; 2 1.422,0
TACTILE_SWITCH_SMD = smd 2 x 1: 1 -2.54,1.905; 2 2.54,1.905; 3 -2.54,-1.905; 4 2.54,-1.905
1X02 = drill 1.016 long: 1 -1.27,0; 2 1.27,0
1X03 = drill 1.016 long: 1 -2.54,0; 2 0,0; 3 2.54,0
SO16' = smd 0.66 x 2.032: 1 -4.445,-3.073; 2 -3.175,-3.073; 3 -1.905,-3.073; 4 -0.635,-3.073; 5 0.635,-3.073; 6 1.905,-3.073; 7 3.175,-3.073; 8 4.445,-3.073; 9 4.445,3.073; 10 3.175,3.073; 11 1.905,3.073; 12 0.635,3.073; 13 -0.635,3.073; 14 -1.905,3.073; 15 -3.175,3.073; 16 -4.445,3.073
SO18L = smd 0.66 x 2.032: 1 -0.635,-4.902; 2 0.635,-4.902; 3 1.905,-4.902; 4 3.175,-4.902; 5 4.445,-4.902; 6 5.715,-4.902; 7 6.985,-4.902; 8 8.255,-4.902; 9 9.525,-4.902; 10 9.525,4.902; 11 8.255,4.902; 12 6.985,4.902; 13 5.715,4.902; 14 4.445,4.902; 15 3.175,4.902; 16 1.905,4.902; 17 0.635,4.902; 18 -0.635,4.902
SPDT-PTH = drill 0.8 square: 1 1.5,-1.75; 2 4,-1.75; 3 6.5,-1.75
TQFP44 = smd 1.5 x 0.5: 1 -5.8,4; 2 -5.8,3.2; 3 -5.8,2.4; 4 -5.8,1.6; 5 -5.8,0.8; 6 -5.8,0; 7 -5.8,-0.8; 8 -5.8,-1.6; 9 -5.8,-2.4; 10 -5.8,-3.2; 11 -5.8,-4; 23 5.8,-4; 24 5.8,-3.2; 25 5.8,-2.4; 26 5.8,-1.6; 27 5.8,-0.8; 28 5.8,0; 29 5.8,0.8; 30 5.8,1.6; 31 5.8,2.4; 32 5.8,3.2; 33 5.8,4 | smd 0.5 x 1.5: 12 -4,-5.8; 13 -3.2,-5.8; 14 -2.4,-5.8; 15 -1.6,-5.8; 16 -0.8,-5.8; 17 0,-5.8; 18 0.8,-5.8; 19 1.6,-5.8; 20 2.4,-5.8; 21 3.2,-5.8; 22 4,-5.8; 34 4,5.8; 35 3.2,5.8; 36 2.4,5.8; 37 1.6,5.8; 38 0.8,5.8; 39 0,5.8; 40 -0.8,5.8; 41 -1.6,5.8; 42 -2.4,5.8; 43 -3.2,5.8; 44 -4,5.8
SOT23-5@1 = smd 0.55 x 1.2: 1 -0.95,-1.3; 2 0,-1.3; 3 0.95,-1.3; 4 0.95,1.3; 5 -0.95,1.3
MSOP8 = smd 0.41 x 1.02: 1 -0.95,-2.4; 2 -0.3,-2.4; 3 0.35,-2.4; 4 1,-2.4; 5 1,2.4; 6 0.35,2.4; 7 -0.3,2.4; 8 -0.95,2.4
SOT23-5 = smd 0.55 x 1.2: 1 -0.95,-1.3; 2 0,-1.3; 3 0.95,-1.3; 4 0.95,1.3; 5 -0.95,1.3
1.8TFTSD = drill 1 square: P$1 55.58,8.5; P$9 2.76,14 | drill 1 octagon: P$2 55.58,11.04; P$3 55.58,13.58; P$4 55.58,16.12; P$5 55.58,18.66; P$6 55.58,21.2; P$7 55.58,23.74; P$8 55.58,26.28; P$10 2.76,16.54; P$11 2.76,19.08; P$12 2.76,21.62 | hole 2.8: 3,3; 3,31.5; 55,31.5; 55,3
GY-521 = drill 0.9 square: P$1 0,0 | drill 0.9 octagon: P$2 2.54,0; P$3 5.08,0; P$4 7.62,0; P$5 10.16,0; P$6 12.7,0; P$7 15.24,0; P$8 17.78,0 | hole 2.8: 0.635,12.7; 17.145,12.7
HMC5883L = drill 0.9 square: P$1 0,5.08 | drill 0.9 octagon: P$2 0,2.54; P$3 0,0; P$4 0,-2.54; P$5 0,-5.08
NRF24L01+ = drill 0.9 square: P$1 -1.016,1.016 | drill 0.9 octagon: P$2 -1.016,-1.524; P$3 -1.016,-4.064; P$4 -1.016,-6.604; P$5 1.524,-6.604; P$6 1.524,-4.064; P$7 1.524,-1.524; P$8 1.524,1.016
PNA460XM = drill 1.016 pad 1.93 square: 1 -2.54,0 | drill 1.016 pad 1.93: 2 0,0; 3 2.54,0
1X04 = drill 1.016 long: 1 -3.81,0; 2 -1.27,0; 3 1.27,0; 4 3.81,0
B5B-XH = drill 1.1 square: P$1 -5.08,0 | drill 1.1: P$2 -2.54,0; P$3 0,0; P$4 2.54,0; P$5 5.08,0

### Placement (x,y rotation side)
BATT  3.81,24.61 270 top
C1  124.71,42.39 90 top
C2  44.45,39.21 180 top
C3  128.91,52.04 270 top
C4  131.44,52.04 270 top
C5  22.86,46.83 0 top
C6  25.02,83.66 0 top
C7  63.5,22.07 270 top
C8  70.48,37.31 180 top
C9  69.85,54.13 0 top
C10  111.76,46.2 0 top
C11  65.72,22.07 270 top
C12  111.76,41.12 0 top
C13  111.76,63.98 90 top
C14  127.64,42.39 270 top
C15  130.3,70.33 0 top
C16  130.3,66.52 0 top
C17  47.31,35.08 0 top
C18  10.16,22.7 0 top
C19  25.4,27.15 180 top
C20  3.81,29.05 0 top
C21  10.16,25.88 180 top
C22  56.26,73.63 0 top
C23  61.34,73.63 180 top
C24  27.94,44.29 0 top
CONN1  128.27,30.96 0 top
CONN2  125.73,79.22 180 top
CONN3  101.22,79.22 180 top
CONN4  100.33,76.68 180 top
CONN5  110.49,30.96 0 top
D3  34.29,37.31 180 top
D4  3.81,32.23 0 top
D13  102.87,70.33 0 top
D13_2  44.45,46.83 0 top
F1  16.51,46.83 0 top
F2  16.51,83.66 0 top
FET1  149.86,48.74 0 top
FET3  22.86,32.54 0 top
JP1  34.29,57.63 270 top
JP2  151.13,53.82 90 top
JP3  134.62,58.89 270 top
JP4  94.61,15.24 0 top
L1  111.76,43.66 0 top
L2  24.13,36.67 0 top
MINIUSB  6.35,79.22 0 top
MINIUSB1  6.35,42.39 0 top
MUX  97.16,8.1 0 top
Q1  124.21,68.42 90 top
Q2  84.45,6.83 180 bottom
Q3  93.34,6.83 180 bottom
Q4  100.97,6.83 180 bottom
Q5  109.86,6.83 180 bottom
Q6  58.8,70.33 180 top
R1  84.45,10.24 180 bottom
R2  130.81,42.39 90 top
R3  84.45,3.41 0 bottom
R4  16.51,78.45 180 top
R5  16.51,80.74 180 top
R6  102.87,67.79 180 top
R7  10.16,69.06 180 top
R8  10.16,65.88 180 top
R9  107.95,51.15 180 top
R10  93.34,9.76 180 bottom
R11  93.34,3.41 0 bottom
R12  100.97,9.76 180 bottom
R13  100.97,3.41 0 bottom
R14  109.86,9.76 180 bottom
R15  109.86,3.41 0 bottom
R16  16.51,41.5 180 top
R17  10.16,32.23 180 top
R18  144.78,47.47 0 top
R19  10.16,29.05 180 top
R20  44.45,44.29 180 top
R21  10.16,56.36 180 top
R22  10.16,52.55 180 top
R23  38.26,38.73 270 top
R24  44.45,41.75 180 top
R25  16.51,44.04 180 top
R26  78.74,81.76 270 top
R27  82.55,81.76 270 top
R46  31.11,31.91 90 top
R49  34.92,31.91 90 top
R51  33.34,27.15 180 top
RX  3.81,69.06 0 top
RX1  3.81,56.36 0 top
S1  36.35,46.2 90 top
S2  135.89,46.7 270 top
SER_CPU2  36.2,81.12 90 top
SERVO1(USONIC)  143.51,56.36 90 top
SERVO2(GRIP)  143.51,74.14 90 top
SERVO3(GRIPROT)  143.51,36.04 90 top
SHIFT1  74HC595D  [SO16']  99.06,55.09 270 top
SHIFT2  74HC595D  [SO16']  99.06,43.66 270 top
STEPPER_DRIVER  88.27,52.55 90 top
SW1  24.77,51.12 90 top
TX  3.81,65.88 0 top
TX1  3.81,52.55 0 top
U1  119.38,55.09 180 top
U2  58.42,55.09 180 top
U3  58.42,22.38 270 top
U4  27.94,23.34 90 top
U5  16.83,33.18 90 top
U$2  39.37,84.04 270 top
U$3  40.64,86.84 0 top
U$4  67.31,86.84 90 top
U$5  41.91,22.07 0 top
U$10  21.59,55.09 270 top
ULTRASONIC  77.47,55.09 90 top
X1  78.74,39.85 90 top
X2  78.74,70.33 90 top

### Tracks (layer width: path | path; a pad name or v marks a point on that pad's centre or on a via)
2D13
  Top 0.305: 52.59,51.91 U2.32 51.41,51.89 50.8,51.28 50.8,47.15 47.94,44.29 R20.1
2D+  (via drill 0.3 pad 0.3)
  Top 0.254: U2.4 62.88,53.49 v62.23,54.13
  Top 0.305: v26.43,41.51 17.95,41.51 R16.1
  Bottom 0.254: v62.23,54.13 43.18,54.13
  Bottom 0.305: 43.18,54.13 30.56,41.51 v26.43,41.51
2D-  (via drill 0.3 pad 0.3)
  Top 0.305: U2.3 61.77,52.69 v61.59,52.86 | R25.1 v21.59,44.04
  Bottom 0.305: v61.59,52.86 60.96,53.5 43.5,53.5 30.48,40.48 25.15,40.48 v21.59,44.04
2MISO  (via drill 0.3 pad 0.3)
  Top 0.305: v50.8,60.17 v50.8,63.98 | v62.55,64.61 64.77,66.83 64.77,74.14 63.18,75.72 56.52,75.72 54.61,77.63 54.61,82.07 55.24,82.71 57.78,82.71 58.42,82.07 58.42,81.28 U$2.P$11 | v62.23,58.9 62.42,59.09 U2.11 | JP1.1 35.88,59.21 38.1,59.21 v40.48,56.83 41.91,55.4 v41.91,50.01
  Bottom 0.305: v40.48,56.83 60.17,56.83 v62.23,58.9 62.04,59.09 51.88,59.09 v50.8,60.17 | v50.8,63.98 51.44,64.61 v62.55,64.61 | U$5.P$4 38.1,18.26 38.1,46.2 v41.91,50.01
2MOSI  (via drill 0.3 pad 0.3)
  Top 0.254: 68.42,62.71 v68.42,60.33
  Top 0.305: v61.91,57.31 62.89,58.29 U2.10 64.25,58.26 v66.36,58.26 | SHIFT1.14 99.69,56.99 98.42,55.72 v98.42,53.5 98.42,50.32 97.16,49.05 94.3,49.05 91.76,46.51 v91.76,44.29 | U$2.P$10 55.91,79.19 58.42,76.68 63.5,76.68 66.04,74.14 66.04,65.09 68.42,62.71
  Bottom 0.254: JP1.4 37.47,56.04 60.64,56.04
  Bottom 0.305: U$5.P$6 50.11,18 U$2.P$6 65.29,33.18 88.27,33.18 91.76,36.67 v91.76,44.29 | 60.64,56.04 v61.91,57.31 | v98.42,53.5 98.11,53.18 85.72,53.18 78.58,60.33 v68.42,60.33 v66.36,58.26
2RESET  (via drill 0.3 pad 0.3)
  Top 0.305: U2.13 61.62,62.1 62.23,62.71 66.04,62.71 66.99,61.75 v66.99,60.33 | 34.77,52.07 38.1,48.74 S1.4 S1.3 38.1,43.5
  Top 0.406: 34.77,52.07 JP1.5 | 38.1,43.5 38.1,40.32 R23.1
  Bottom 0.305: v66.99,60.33 66.2,60.33 64.77,58.9 64.77,56.36 64.29,55.88 63.02,55.88 61.91,54.77 42.86,54.77 39.05,50.96 35.88,50.96 JP1.5
2RXLED  (via drill 0.3 pad 0.3)
  Top 0.305: U2.8 68.91,56.69 71.12,58.9 71.12,63.34 70.64,63.82 v69.85,63.82 | v52.39,63.82 49.21,66.99 43.97,66.99 38.89,61.91 22.54,61.91 16.99,56.36 R21.1
  Bottom 0.305: v69.85,63.82 v52.39,63.82
2SCK  (via drill 0.3 pad 0.3)
  Top 0.254: JP1.3 35.56,53.82 v40.64,53.82
  Top 0.305: SHIFT2.11 103.82,41.75 v104.14,42.07 | v103.82,53.18 SHIFT1.11 v99.69,53.18 | v62.71,56.83 63.36,57.49 U2.9 67.17,57.49 v67.31,57.63 | v92.87,32.23 101.6,32.23 104.14,34.77 104.14,38.58 v105.41,39.85 | U$2.P$12 60.99,80.46 66.67,74.77 66.67,65.56 69.85,62.39 69.85,60.17 v69.22,59.53
  Bottom 0.254: U$5.P$3 41.91,16.99 51.63,16.99
  Bottom 0.305: 51.63,16.99 U$2.P$7 66.87,32.23 v92.87,32.23 | v103.82,53.18 104.14,52.86 v104.14,42.07 105.41,40.8 v105.41,39.85 | v40.64,53.82 42.23,55.4 61.28,55.4 v62.71,56.83 | v67.31,57.63 v69.22,59.53 73.66,59.53 75.56,57.63 80.01,57.63 85.41,52.23 98.74,52.23 v99.69,53.18
2TXLED  (via drill 0.3 pad 0.3)
  Top 0.305: U2.22 54.42,62.9 49.53,67.79 43.18,67.79 38.1,62.71 21.59,62.71 v16.51,57.63 | v15.24,52.55 R22.1
  Bottom 0.305: v16.51,57.63 16.51,53.82 v15.24,52.55
2XTAL1
  Top 0.406: C22.1 54.86,71.49 Q6.1 58.42,67.93 U2.17
2XTAL2
  Top 0.406: C23.1 62.74,71.49 Q6.2 59.22,67.97 U2.16
3.3V
  Top 0.305: C11.1 C7.1 63.37,23.33 62.23,23.33 | U$2.P$8 65.65,23.47 C11.1 | CONN5.2 106.68,29.69 105.41,28.42 77.47,28.42 72.39,23.34 65.85,23.34 C11.1 | 62.23,23.33 U3.5 | U$5.P$8 50.42,23.08 53.34,20.16 60.96,20.16 61.59,20.8 61.59,22.7 62.23,23.33
A0
  Top 0.305: U1.36 116.98,38.44 121.92,33.5 CONN1.1
A1
  Top 0.305: U1.37 117.78,38.91 124.46,32.23 CONN1.2
A2
  Top 0.305: U1.38 118.58,39.38 124.46,33.5 125.73,33.5 127,32.23 CONN1.3
A3
  Top 0.305: U1.39 119.38,39.85 124.46,34.77 127,34.77 129.54,32.23 CONN1.4
A4
  Top 0.305: U1.40 120.18,40.32 124.46,36.04 128.27,36.04 132.08,32.23 CONN1.5
A5
  Top 0.305: U1.41 120.98,40.79 124.46,37.31 129.54,37.31 134.62,32.23 CONN1.6
AREF  (via drill 0.3 pad 0.3)
  Top 0.305: U1.42 121.78,45.07 123.19,43.66 | 123.19,43.66 124.58,43.66 C1.2 | CONN3.8 93.98,78.33 CONN4.8 99.06,71.6 99.06,66.52 105.41,60.17 105.41,56.36 107.95,53.82 v107.95,41.12 | v122.24,43.02 122.56,43.02 123.19,43.66 | U2.42 60.82,42.53 v63.5,39.85 66.04,37.31 C8.2 | v107.31,39.21 105.41,37.31 105.41,34.77 100.01,29.37 77.15,29.37 72.39,24.61 68.58,24.61 67.31,25.88 67.31,32.23 v63.5,36.04
  Bottom 0.254: v63.5,36.04 v63.5,39.85
  Bottom 0.305: v107.95,41.12 107.31,40.48 v107.31,39.21 107.79,38.74 109.38,38.74 112.08,41.43 120.65,41.43 v122.24,43.02
AVCC  (via drill 0.3 pad 0.3)
  Top 0.254: U1.24 114.8,58.29 115.09,58.58 117.16,58.58 118.11,57.63 v118.11,52.67
  Top 0.305: U1.44 v123.38,47.28 124.46,46.2 127,46.2 127.64,45.56 C14.1 | U1.24 112.37,58.29 111.76,58.9 C13.1 | U2.24 58.71,58.29 60.01,56.99 v60.01,52.71 | U2.44 62.42,46.7 v62.55,46.51 62.55,43.34 v64.77,41.12 | L1.2 v115.57,43.66 115.57,35.4 118.75,32.23 118.75,29.69 118.11,29.05 107.31,29.05 105.41,27.15 78.74,27.15 v77.47,25.88 | v66.04,30 v62.87,33.18
  Bottom 0.305: v123.38,47.28 119.76,43.66 v115.57,43.66 118.11,46.2 v118.11,52.67 | v60.01,52.71 60.01,51.7 U2.44 62.42,46.7 v62.55,46.51 | v77.47,25.88 70.17,25.88 v66.04,30 | v62.87,33.18 62.87,33.81 64.77,35.72 v64.77,41.12
BATT_OUT
  Top 0.406: R46.2 R49.2 | R49.2 34.92,36.51 D3.C 33.29,37.51 32.23,38.58 31.43,38.58 26.52,43.49 | 34.92,33.34 R49.2 | SW1.1 26.52,43.49 | 26.52,43.49 C24.1
D4  (via drill 0.3 pad 0.3)
  Top 0.254: v115.57,57.79 115.27,57.49 U1.25
  Top 0.305: CONN2.5 124.46,76.55 123.95,76.04 v120.27,76.04
  Bottom 0.254: 115.57,71.6 v115.57,57.79
  Bottom 0.305: v120.27,76.04 120.02,76.04 115.57,71.6
D5  (via drill 0.3 pad 0.3)
  Top 0.254: v116.84,57.79 116.84,53.82
  Top 0.305: U1.31 115.71,52.69 116.84,53.82
  Bottom 0.254: 116.84,67.79 v116.84,57.79
  Bottom 0.305: CONN2.6 121.92,72.87 116.84,67.79
D6
  Top 0.305: U1.27 112.23,55.89 109.22,58.9 109.22,69.06 CONN2.7
D7  (via drill 0.3 pad 0.3)
  Top 0.305: U1.1 125.18,49.29 v125.73,48.74 | v130.81,81.12 v128.14,81.12
  Bottom 0.305: v125.73,48.74 138.43,48.74 139.7,50.01 139.7,78.58 137.16,81.12 v130.81,81.12 | v128.14,81.12 118.75,81.12 CONN2.8
D8
  Top 0.305: CONN3.1 111.76,78.33 CONN4.1 111.76,75.41 107.95,71.6 107.95,58.9 111.76,55.09 U1.28
D9
  Top 0.305: CONN3.2 109.22,78.33 CONN4.2 109.22,74.01 107.31,72.1 107.31,58.52 111.54,54.29 U1.29
D10
  Top 0.305: CONN3.3 106.68,78.33 CONN4.3 106.68,58.13 111.33,53.49 U1.30
D11  (via drill 0.3 pad 0.3)
  Top 0.305: CONN4.4 104.14,78.33 CONN3.4 | U1.12 123.38,59.09 v123.19,58.9
  Bottom 0.254: 119.25,58.9 117.35,56.99 114.81,56.99 104.14,67.66
  Bottom 0.305: v123.19,58.9 119.25,58.9 | 104.14,67.66 CONN4.4
D12  (via drill 0.3 pad 0.3)
  Top 0.305: CONN4.5 101.6,78.33 CONN3.5 | U1.26 112.57,56.69 110.62,58.64 v110.62,60.17
  Bottom 0.305: CONN4.5 102.87,75.41 102.87,67.79 103,67.79 v110.62,60.17
D13
  Top 0.305: CONN3.6 99.06,78.33 CONN4.6 99.06,75.41 100.33,74.14 105.09,74.14 106.05,73.18 106.05,67.79 | U1.32 112.04,51.89 106.05,57.88 106.05,67.79 | R6.1 106.05,67.79
D+  (via drill 0.3 pad 0.3)
  Top 0.254: v123.51,53.5 125.17,53.5 U1.4
  Top 0.305: v28.89,64.93 17.93,75.89 R4.1
  Bottom 0.254: 119.38,55.09 85.72,55.09
  Bottom 0.305: v123.51,53.5 120.97,53.5 119.38,55.09 | 85.72,55.09 79.06,61.75 41.59,61.75 38.42,64.93 v28.89,64.93
D-  (via drill 0.3 pad 0.3)
  Top 0.305: U1.3 v122.87,52.69 | 18,80.8 arc90 R5.1 18.19,80.49 20.32,80.49 v36.83,63.98
  Bottom 0.254: 119.06,54.45 85.41,54.45 | 78.74,61.12 41.27,61.12
  Bottom 0.305: v122.87,52.69 120.83,52.69 119.06,54.45 | 85.41,54.45 78.74,61.12 | 41.27,61.12 38.42,63.98 v36.83,63.98
ECHO  (via drill 0.3 pad 0.3)
  Top 0.305: ULTRASONIC.2 74.93,53.82 v66.04,44.93 | v56.83,46.2 56.83,49.27 U2.37
  Bottom 0.305: v66.04,44.93 58.42,44.93 v56.83,46.2
GND  (via drill 0.3, 0.3 pad 0.3)
  Top 0.254: 114.3,46.2 116.18,48.08 U1.35 116.18,50.3 116.84,50.96 122.24,50.96 122.56,50.64 122.56,49.31 U1.43 122.58,50.67 v122.87,50.96 | C12.2 111.76,42.52 111.76,44.8 | U1.5 126.53,54.29 127,53.82 v127,52.86 128.91,50.96 C3.2 | U1.15 120.98,62.4 v121.92,63.34 | U3.2 v58.74,22.38 | v105.41,75.41 v100.33,75.41 | v60.8,66.99 60.96,66.83 60.96,63.98 60.02,63.04 U2.15 60.01,60.87 60.01,59.85 59.24,59.09 U2.23 | U2.35 55.22,50.62 55.56,50.96 61.28,50.96 61.59,50.64 61.59,49.31 U2.43 61.59,49.26 v61.59,47.47 61.59,43.02 v62.87,41.75 | U2.5 65.57,54.29 66.04,53.82 66.04,53.18 v66.67,52.55 | 32.72,23.04 33.02,23.34 | U5.2 20,33.18 20.32,33.5
  Top 0.305: v113.67,60.8 114.3,60.17 | 111.76,44.8 C10.2 114.3,46.2
  Top 0.406: U4.2 32.72,23.04
  Bottom 0.254: v122.87,50.96 124.14,50.96 124.46,51.28 | v127,52.86 127,53.82 | v62.87,41.75 63.5,41.12
  other vias: 100.01,44.29 57.15,52.7 113.03,69.06 114.3,76.68 97.79,75.41 87.63,65.25 88.9,66.52 90.17,67.79 90.17,65.25 92.71,65.25 91.44,66.52 74.93,30.64 81.28,30.64 90.17,30.64 93.66,36.35 86.36,38.58 86.36,39.85 87.63,41.12 88.9,39.85 88.9,38.58 83.82,38.58 83.82,39.85 85.09,41.12 65.41,43.02 97.79,30.64 97.79,25.56 88.9,25.56 61.28,37.31 51.44,41.75 50.01,44.61 48.26,47.47 63.34,68.58 70.33,65.56 92.71,70.33 93.98,71.6 91.44,71.6 95.25,72.87 90.17,72.87 92.71,72.87 88.9,58.9 83.82,48.1 92.08,50.64 90.81,50.32 92.08,49.05 91.44,49.69 92.71,50.01 68.58,25.88 68.26,20.8 68.26,21.75 59.69,22.38 68.42,68.42 58.9,72.07 57.94,72.07 59.85,72.07 62.55,50.96 69.85,52.23 68.26,51.91 23.81,29.69 33.66,23.34 35.56,23.34 34.61,22.38 33.66,21.43 35.56,21.43 25.08,29.69 23.5,23.65 23.5,25.24 40.96,41.43 40.96,40.16 40.96,38.89 48.26,48.74 49.21,49.69 104.3,57.15 106.36,48.74 106.36,53.02 68.42,70.96 68.42,73.5 68.42,76.04 65.88,78.58 70.96,76.04 70.96,73.5 73.5,76.04 68.42,78.58 65.88,81.12 70.96,70.96 70.96,78.58 73.5,78.58 51.12,76.52 51.12,78.74 48.9,78.74 44.13,70.33 41.75,70.33 39.21,70.33 27.94,79.22 30.48,76.68 33.02,74.14 35.56,71.6 15.24,74.14 17.78,63.98 15.24,63.98 5.08,61.44 7.62,61.44 5.08,58.9 7.62,58.9 17.78,20.8 17.78,23.34 17.78,25.88 17.78,28.42 28.42,48.74 32.38,49.53 71.6,43.66 71.6,46.2 71.6,41.12 53.82,36.04 51.28,36.04 51.28,33.5 53.82,33.5 110.97,68.26 27.62,32.23 27.62,29.69 27.62,34.77 25.08,32.23
  pour Top (isolate 0.61): -1.27,105.89 156.21,103.35 156.21,8.1 -1.27,4.29
  pour Bottom (isolate 0.61): 77.47,103.35 77.47,88.11 142.24,88.11 149.86,81.76 156.21,81.76 156.21,29.69 149.86,29.69 142.24,22.07 77.47,22.07 77.47,6.83 35.56,6.83 35.56,18.26 0,18.26 0,91.92 35.56,91.92 35.56,103.35
IR
  Top 0.305: U$10.1 24.13,60.17 38.5,60.17 39.45,59.21 49.93,59.21 51.65,57.49 U2.25
IR_GND  (via drill 0.3)
  Top 0.203: MUX.8 102.87,6.57 102.87,14.61 JP4.6
  Top 0.254: MUX.6 100.97,5.3 v100.97,6.83
  Top 0.305: MUX.8 MUX.7 MUX.6
  Bottom 0.305: Q2.4 84.31,7.73 Q2.2 88,7.73 89.8,5.93 Q3.4 93.19,7.73 Q3.2 96.25,7.73 98.06,5.93 Q4.4 100.06,5.93 v100.97,6.83 101.86,7.73 Q4.2 104.51,7.73 106.31,5.93 Q5.4 109.7,7.73 Q5.2
IR_OUT  (via drill 0.3 pad 0.3)
  Top 0.305: MUX.3 95.25,4.29 95.57,3.97 102.87,3.97 103.98,5.08 v103.98,13.89
  Bottom 0.203: JP4.4 98.42,16.51 101.92,16.51 103.98,14.45 v103.98,13.89
IR_VCC  (via drill 0.3 pad 0.3)
  Top 0.305: MUX.16 v92.71,12.38
  Bottom 0.305: 85.72,10.79 R1.2 | 97.95,1.27 104.3,1.27 106.44,3.41 R15.2 | 97.95,1.27 89.53,1.27 | 89.53,1.27 83.74,1.27 83.03,1.98 R3.2 81.52,3.41 80.64,4.29 80.64,11.27 81.68,12.3 84.93,12.3 85.88,11.36 R1.2 | R11.2 89.93,3.41 89.53,3.02 89.53,1.27 | R13.2 98.35,3.41 97.95,3.02 97.95,1.27 | v92.71,12.38 92.87,12.54 | R1.2 88.02,12.38 v92.71,12.38 | R14.2 111.28,11.04 110.97,11.35 102.23,11.35 | 102.23,11.35 94.61,11.35 | 94.61,11.35 93.74,11.35 v92.71,12.38 | R10.2 94.77,11.2 94.61,11.35 | R12.2 102.39,11.2 102.23,11.35 | JP4.2 92.71,15.88 v92.71,12.38
IRA
  Top 0.203: JP4.1 96.84,13.02 98.19,13.02 99.06,12.14 MUX.11
IRB
  Top 0.203: JP4.3 100.33,12.07 MUX.10
IRC
  Top 0.203: JP4.5 101.6,13.34 MUX.9
MISO
  Top 0.254: JP3.1 134.42,59.09 U1.11
MOSI
  Top 0.203: U1.10 132.69,58.29 133.35,57.63 135.89,57.63 135.89,57.62 JP3.4
MUX0  (via drill 0.3 pad 0.3)
  Top 0.305: v87.63,3.02 87,3.65 87,12.14 88.5,13.65 94.85,13.65 96.52,11.99 MUX.13
  Bottom 0.305: R3.1 86.41,3.54 Q2.3 86.36,5.88 86.36,2.7 86.68,3.02 v87.63,3.02
MUX1  (via drill 0.3 pad 0.3)
  Top 0.305: v96.68,2.22 91.28,2.22 88.58,4.92 88.58,12.38 89.3,13.1 94.38,13.1 95.25,12.22 MUX.14
  Bottom 0.305: 95.25,5.88 Q3.3 95.3,3.54 R11.1 95.81,3.02 v96.68,2.22
MUX2  (via drill 0.3 pad 0.3)
  Top 0.305: MUX.15 93.98,8.73 91.52,6.27 91.52,4.13 92.39,3.25 v104.46,3.25
  Bottom 0.305: 102.23,3.02 102.92,3.7 Q4.3 102.92,3.54 R13.1 102.55,3.25 v104.46,3.25
MUX3  (via drill 0.3 pad 0.3)
  Top 0.305: v97.79,12.22 MUX.12
  Bottom 0.305: R15.1 111.81,3.54 Q5.3 112.77,5.93 113.67,6.83 113.67,10.8 111.6,12.86 98.42,12.86 v97.79,12.22
MUX_OUT  (via drill 0.3 pad 0.3)
  Top 0.305: v102.23,37.31 98.42,33.5 92.71,33.5 91.44,32.23 68.58,32.23 60.02,40.79 U2.41
  Bottom 0.254: 110.49,37.31 v102.23,37.31
  Bottom 0.305: JP2.4 146.05,53.82 146.05,52.55 133.35,39.85 113.03,39.85 110.49,37.31
N$1
  Top 0.406: TX.C R8.2
N$2
  Top 0.406: MINIUSB.2 12.7,80.02 13.42,80.74 R5.2
N$3
  Top 0.305: U2.21 55.22,63.37 49.53,69.06
  Top 0.406: SER_CPU2.1 38.73,79.85 49.53,69.06
N$4
  Top 0.305: U2.20 56.02,63.84 48.26,71.6
  Top 0.406: 48.26,71.6 37.47,82.39 SER_CPU2.2
N$5
  Top 0.406: MINIUSB.3 12.7,79.22 13.46,78.45 R4.2
N$6
  Top 0.305: R9.1 113.54,51.12 U1.33
N$7
  Top 0.406: D13.A R6.2
N$8
  Top 0.305: U2.6 66.04,55.09 66.99,54.13 C9.1
N$9
  Top 0.406: R7.2 RX.C
N$10
  Bottom 0.305: Q2.1 83.03,8.25 R1.1
N$11
  Bottom 0.305: Q3.1 91.92,8.25 R10.1
N$12
  Bottom 0.305: Q4.1 99.54,8.25 R12.1
N$13
  Top 0.406: MINIUSB.1 11.76,80.82 12.7,81.76 12.7,83.03 13.34,83.66 F2.1
N$14
  Bottom 0.305: Q5.1 108.43,8.25 R14.1
N$15
  Top 0.305: U1.6 128.4,55.09 128.91,54.58 C3.1
N$16
  Top 0.305: R18.2 146.47,47.74 FET1.1
N$17
  Top 0.305: U2.33 52.62,45.48 48.9,41.75 R24.1
N$18
  Top 0.406: F1.1 13.34,46.83 12.7,46.2 12.7,45.18 11.51,43.99 MINIUSB1.1
N$19
  Top 0.305: U4.1
  Top 0.406: FET3.1 21.91,22.06 22.54,21.43 27.94,21.43 28.89,22.38 U4.1
N$20
  Top 0.305: U5.5 14.61,32.23 13.34,30.96 13.34,29.69 12.7,29.05 R19.1
N$21
  Top 0.305: U5.1 17.46,32.23 16.51,33.18 13.65,33.18 12.7,32.23 R17.1
N$22
  Top 0.305: D4.C R17.2
N$23
  Top 0.305: 32.07,26.99 R51.2
  Top 0.406: U4.4 31.48,24.34 32.07,24.92 32.07,26.99 | R51.2 31.92,28.58 32.38,29.05 34.61,29.05 34.92,29.37 R49.1
N$24
  Top 0.305: 25.53,36.51 L2.2 25.4,36.54
  Top 0.406: D3.A 25.53,36.51 | FET3.3 23.86,33.54 25.4,35.08 25.4,36.54
N$25
  Top 0.305: 26.94,24.34 26.67,24.34 26.8,24.47
  Top 0.406: U4.8 27.62,22.39 28.26,23.02 | 28.26,23.02 28.93,23.69 U4.3 | U4.5 26.67,24.34 | 26.94,24.34 28.26,23.02 | 26.8,24.47 C19.1 28.89,27.15 31.11,29.37 R46.1
N$26
  Top 0.254: STEPPER_DRIVER.11 85.72,60.8 86.36,61.44 86.36,65.25 X2.P$4
N$27
  Top 0.254: STEPPER_DRIVER.12 81.92,59.53 81.28,60.17 81.28,67.79 X2.P$3
N$28
  Top 0.254: STEPPER_DRIVER.13 81.92,58.26 80.01,60.17 80.01,66.52 X2.P$2
N$29
  Top 0.254: STEPPER_DRIVER.14 81.92,56.99 78.74,60.17 X2.P$1
N$30
  Top 0.254: STEPPER_DRIVER.15 81.92,55.72 80.64,54.45 80.64,44.29 X1.P$4
N$31
  Top 0.254: STEPPER_DRIVER.16 81.92,54.45 81.28,53.82 81.28,42.39 X1.P$3
N$32
  Top 0.254: STEPPER_DRIVER.17 82.23,53.18 81.92,52.86 81.92,40.48 X1.P$2
N$33
  Top 0.254: X1.P$1 80.01,34.77 82.55,37.31 82.55,45.24 86.04,48.74 86.04,50.96 85.09,51.91 STEPPER_DRIVER.18
N$34
  Top 0.305: R20.2 43.03,46.75 D13_2.A
N$35
  Top 0.406: TX1.C R22.2
N$36
  Top 0.406: RX1.C R21.2
N$37
  Top 0.305: MINIUSB1.2 12.74,43.19 13.59,44.04 R25.2
N$38
  Top 0.305: MINIUSB1.3 12.7,42.39 13.59,41.5 R16.2
N$41  (via drill 0.3 pad 0.3)
  Top 0.305: SHIFT2.15 v100.01,46.83
  Bottom 0.254: 110.49,36.35 101.28,36.35 99.06,38.58
  Bottom 0.305: JP2.1 148.59,51.28 145.73,51.28 133.67,39.21 113.35,39.21 110.49,36.35 | v100.01,46.83 99.06,45.88 99.06,38.58
N$42  (via drill 0.3 pad 0.3)
  Top 0.305: v97.79,48.1 SHIFT2.1
  Bottom 0.254: 110.81,35.72 100.97,35.72 98.5,38.18 98.5,47.39 v97.79,48.1
  Bottom 0.305: JP2.3 153.03,54.45 153.03,53.18 150.5,50.64 146.05,50.64 133.99,38.58 113.67,38.58 110.81,35.72
N$43  (via drill 0.3 pad 0.3)
  Top 0.305: v151.76,50.64 153.03,51.91 153.03,57.94 152.08,58.9 JP2.5 | SHIFT2.2 v97.79,46.83
  Bottom 0.254: 111.12,34.77 100.33,34.77 97.79,37.31
  Bottom 0.305: 111.12,34.77 113.98,37.62 134.3,37.62 146.69,50.01 151.13,50.01 v151.76,50.64 | v97.79,46.83 97.79,37.31
N$44  (via drill 0.3 pad 0.3)
  other vias: 133.35,77.95
N$45
  Top 0.254: FET1.3 149.86,57.63 JP2.6
NRF_CE  (via drill 0.3 pad 0.3)
  Top 0.305: v47.78,52.07 50,54.29 U2.29
  Bottom 0.305: U$5.P$2 38.73,22.7 38.73,43.02 v47.78,52.07
NRF_CSN  (via drill 0.3 pad 0.3)
  Top 0.305: v49.05,52.07 50.47,53.49 U2.30
  Bottom 0.305: U$5.P$7 42.23,21.75 42.23,24.29 39.37,27.15 39.37,42.39 v49.05,52.07
NRF_IRQ  (via drill 0.3 pad 0.3)
  Top 0.305: U$5.P$5 47.5,19.53 v49.53,19.53 | v67.31,50.01 66.23,51.09 U2.1
  Bottom 0.305: v67.31,50.01 67.31,36.67 61.91,30.96 58.74,30.96 56.83,29.05 56.83,26.83 v49.53,19.53
RESET  (via drill 0.3 pad 0.3)
  Top 0.305: U1.13 122.58,62.1 123.19,62.71 125.73,62.71 v127,61.44 | v133.22,55.09 133.34,55.09 JP3.5 133.99,53.18 S2.3 v133.99,46.83 S2.4 133.99,41.5 133.45,40.96 R2.1 | v108.46,39.85 108.46,34 107.95,33.5 105.41,33.5 104.14,32.23 CONN5.1
  Bottom 0.305: v127,61.44 130.18,58.26 130.18,55.85 130.94,55.09 v133.22,55.09 | v133.99,46.83 124.21,46.83 119.76,42.39 111,42.39 v108.46,39.85
RX-I
  Top 0.305: CONN2.1 134.62,76.68 132.08,74.14 123.19,74.14 116.98,67.93 U1.20
RXLED  (via drill 0.3 pad 0.3)
  Top 0.305: U1.8 122.89,56.69 v122.87,56.67 | v13.97,69.06 R7.1 11.43,69.06
  Bottom 0.254: 119.38,55.72 86.04,55.72
  Bottom 0.305: v122.87,56.67 120.33,56.67 119.38,55.72 | 86.04,55.72 79.38,62.39 42.23,62.39 38.1,66.52 19.05,66.52 16.51,69.06 v13.97,69.06
S1
  Top 0.406: SHIFT1.15 100.33,58.26 97.79,60.8 STEPPER_DRIVER.8
S1OVERFLOW
  Top 0.305: SHIFT2.14 103.5,45.56 104.14,46.2 104.14,50.01 103.5,50.64 SHIFT1.9
S2
  Top 0.406: SHIFT1.1 STEPPER_DRIVER.7
S2O4  (via drill 0.3 pad 0.3)
  Top 0.305: v139.7,41.12 139.7,46.2 140.97,47.47 R18.1 | v94.3,45.56 SHIFT2.3
  Bottom 0.254: 111.44,33.81 100.01,33.81 93.34,40.48
  Bottom 0.305: v139.7,41.12 135.25,36.67 114.3,36.67 111.44,33.81 | 93.34,40.48 93.34,44.61 v94.3,45.56
S3
  Top 0.406: SHIFT1.2 STEPPER_DRIVER.6
S4
  Top 0.406: STEPPER_DRIVER.5 SHIFT1.3
S5
  Top 0.406: STEPPER_DRIVER.4 SHIFT1.4
S6
  Top 0.406: STEPPER_DRIVER.3 SHIFT1.5
S7
  Top 0.406: STEPPER_DRIVER.2 SHIFT1.6
S8
  Top 0.406: STEPPER_DRIVER.1 SHIFT1.7
S_GRIP  (via drill 0.3, 0.3 pad 0.3)
  Top 0.305: v89.22,81.44 90.49,82.71 134.62,82.71 140.65,76.68 SERVO2(GRIP).3 | v87.63,79.85 85.09,79.85 83.34,78.11 v77.63,78.11 | v48.9,65.25 48.26,64.61 v48.26,60.17 | U2.27 48.73,55.89 48.26,56.36 v48.26,57.63
  Bottom 0.305: v89.22,81.44 v87.63,79.85 | v48.9,65.25 60.96,65.25 62.23,66.52 68.58,66.52 75.41,73.34 75.41,76.04 v77.63,78.11 | v48.26,57.63 v48.26,60.17
S_GRIPROT  (via drill 0.3 pad 0.3)
  Top 0.305: U2.12 65.32,60.89 v68.58,57.63
  Bottom 0.254: 111.76,33.18 99.69,33.18 92.71,40.16
  Bottom 0.305: SERVO3(GRIPROT).3 138.43,38.58 135.89,36.04 114.62,36.04 111.76,33.18 | 92.71,40.16 92.71,46.2 87.63,51.28 85.09,51.28 | 82.55,48.74 76.2,48.74 73.66,51.28 73.66,55.09 71.12,57.63 v68.58,57.63
  Bottom 0.406: 85.09,51.28 82.55,48.74
S_USONIC  (via drill 0.3 pad 0.3)
  Top 0.305: v101.44,38.1 97.47,34.13 92.08,34.13 91.12,33.18 68.9,33.18 v60.96,41.12 | v54.61,52.55 54.47,52.69 U2.31
  Bottom 0.254: 110.33,38.1 v101.44,38.1
  Bottom 0.305: SERVO1(USONIC).3 141.6,58.9 140.97,58.26 140.97,48.42 133.03,40.48 112.71,40.48 110.33,38.1 | v60.96,41.12 58.42,41.12 54.61,44.93 v54.61,52.55
SCK
  Top 0.305: JP3.3 133.35,56.36 132.22,57.49 U1.9
SCL  (via drill 0.3 pad 0.3)
  Top 0.305: CONN3.10 88.9,78.33 CONN4.10 | U1.18 v118.58,67.37 | CONN3.10 91.57,80.99 126.11,80.99 127,80.11 CONN2.4 | CONN3.10 87.25,81.76 79.38,81.76 78.74,82.39 R26.1 78.74,84.3 78.11,84.93 69.22,84.93 U$4.P$3 | U2.18 57.62,64.78 45.72,76.68 U$3.P$3
  Bottom 0.305: CONN2.4 127,75.79 v118.58,67.37 | U$4.P$3 66.04,88.11 46.99,88.11 U$3.P$3
SD_CS  (via drill 0.3 pad 0.3)
  Top 0.305: v46.99,64.61 v46.99,60.17 | v46.99,57.63 46.99,56.36 48.26,55.09 U2.28
  Bottom 0.305: U$2.P$9 53.37,71.57 54.61,70.33 54.61,67.79 53.34,66.52 48.26,66.52 46.99,65.25 v46.99,64.61 | v46.99,60.17 v46.99,57.63
SDA  (via drill 0.3 pad 0.3)
  Top 0.305: U1.19 v117.78,64.99 | CONN3.9 91.44,78.33 CONN4.9 | v88.91,83.18 R27.1 82.55,84.3 81.28,85.57 71.12,85.57 U$4.P$4 68.58,88.11 49.53,88.11 U$3.P$4 46.99,85.57 v46.99,83.03 | U2.19 56.82,64.31 v53.34,67.79
  Bottom 0.305: v117.78,64.99 117.86,64.99 129.54,76.68 CONN2.3 129.54,81.12 128.27,82.39 115.32,82.39 113.92,80.99 94.11,80.99 CONN3.9 92.39,79.28 92.39,82.87 92.08,83.18 v88.91,83.18 | v53.34,67.79 53.34,70.33 46.99,76.68 v46.99,83.03
SHIFT_RCK  (via drill 0.3 pad 0.3)
  Top 0.305: SHIFT1.12 104.14,54.45 104.78,53.82 104.78,43.66 104.14,43.02 SHIFT2.12 100.65,43.02 100.33,42.7 v100.33,41.75 | U2.26 50.47,56.69 48.58,58.58 45.72,58.58 44.45,57.31 44.45,31.27 45.72,30 v45.72,26.51 | v48.9,21.43 50.16,21.43 53.34,18.26 68.58,18.26 v77.47,27.15 | v100.33,39.21 v96.2,35.08
  Bottom 0.305: v45.72,26.51 45.72,24.61 v48.9,21.43 | v100.33,41.75 v100.33,39.21 | v96.2,35.08 93.98,32.86 93.98,28.42 92.71,27.15 v77.47,27.15
TFT_CS  (via drill 0.3 pad 0.3)
  Top 0.305: U2.40 v59.22,33.66
  Bottom 0.305: v59.22,33.66 58.74,33.18 57.15,33.18 52.95,28.98 U$2.P$3
TFT_DC
  Top 0.305: U2.38 57.62,31.12 58.1,30.64 58.1,28.54 U$2.P$5
TFT_RST  (via drill 0.3 pad 0.3)
  Top 0.305: U2.39 v58.42,32.23
  Bottom 0.305: v58.42,32.23 55.49,29.3 U$2.P$4
TRIG  (via drill 0.3 pad 0.3)
  Top 0.305: ULTRASONIC.3 76.2,56.36 v63.5,43.66 | v56.2,45.24 56.02,45.42 U2.36
  Bottom 0.305: v63.5,43.66 57.78,43.66 v56.2,45.24
TX-O
  Top 0.305: CONN2.2 132.08,76.68 130.81,75.41 123.19,75.41 116.18,68.4 U1.21
TXLED  (via drill 0.3 pad 0.3, 0.6)
  Top 0.254: v119.38,56.99 119.38,57.63
  Top 0.305: U1.22 115.38,59.4 115.57,59.21 117.79,59.21 119.38,57.63 | v19.21,69.06 17.78,69.06 14.61,65.88 R8.1
  Bottom 0.254: 86.36,56.36 118.75,56.36 v119.38,56.99
  Bottom 0.305: 86.36,56.36 79.69,63.02 42.55,63.02 38.42,67.15 21.11,67.15 v19.21,69.06
USB_VIN  (via drill 0.3, 0.6)
  Top 0.406: C20.1 2.31,29.05 D4.A 4.21,34.13 U5.4 v14.29,34.13 | v19.84,46.83 C5.1 F1.2 | F2.2 v20.8,83.66 C6.1
  Bottom 0.406: v14.29,34.13 16.51,36.35 16.51,44.61 18.73,46.83 v19.84,46.83 20.95,46.83 23.97,49.85 23.97,55.07 SW1.3 23.5,60.64 11.43,60.64 8.73,63.34 8.73,71.6 v20.8,83.66
VBATT  (via drill 0.3 pad 0.3)  (1 unrouted)
  Top 0.305: 11.56,21.56 C18.2 | 17.46,34.13 U5.3
  Top 0.406: 5.12,20.8 10.79,20.8 11.56,21.56 | C18.2 C21.1 12.7,25.88 14.61,27.78 14.61,30.32 15.24,30.96 v15.88,30.96 | v16.83,34.13 17.46,34.13 | U5.3 19.68,34.13 20.32,34.77 20.32,36.04 20.95,36.67 L2.1 | BATT.2 3.94,21.94 5.08,20.8
  Bottom 0.406: v15.88,30.96 16.83,31.91 v16.83,34.13
VCC  (via drill 0.3, 0.3 pad 0.3)  (1 unrouted)
  Top 0.305: U1.7 125.22,55.85 | 131.44,54.58 C4.1 | 110.36,46.07 110.49,46.2 | 110.49,46.33 C10.1 | RX1.A TX.A | U3.1 55.88,23.34 | 62.23,85.57 U$4.P$1 | SHIFT1.10 100.01,51.91 99.06,50.96 99.06,48.1 | 99.06,48.1 99.06,41.12 99.69,40.48 SHIFT2.10 | SHIFT2.16 99.06,48.1 | JP2.2 146.05,56.36 146.69,56.99 | v45.85,37.44 45.72,37.31 | TX1.A 2.31,51.51 3.81,50.01 19.05,50.01 U$10.3
  Top 0.406: TX.A RX.A | 131.44,54.58 130.18,55.85 125.22,55.85 121.78,55.85 | 121.78,51.89 116.81,51.89 115.38,50.45 U1.34 112.31,49.29 v111.76,48.74 110.49,47.47 110.49,46.33 | 121.78,51.89 U1.2 126.39,51.89 127,51.28 127,49.37 130.81,45.56 R2.2 | U1.14 121.78,55.85 | 121.78,55.85 121.78,51.89 | v131.44,56.36 C4.1 | 110.36,46.07 L1.1 C12.1 110.36,33.37 109.22,32.23 CONN5.3 | RX1.A TX1.A | U3.1 51.76,23.33 47.87,27.22 U$2.P$1 47.87,30.08 45.85,32.1 45.85,35.14 | 55.88,23.34 55.88,21.43 U3.3 | R26.2 R27.2 | R26.2 X2.P$5 | R26.2 76.35,80.33 72.39,84.3 63.5,84.3 62.23,85.57 | X1.P$5 80.01,46.2 80.01,57.94 79.06,58.9 ULTRASONIC.4 75.88,58.9 | 75.88,58.9 75.25,59.53 75.25,62.39 76.83,63.98 76.83,73.5 X2.P$5 | SHIFT2.10 104.14,40.48 106.36,42.7 v106.36,46.2 | JP3.2 139.69,56.36 SERVO1(USONIC).2 146.05,56.36 | SERVO3(GRIPROT).2 145.41,36.04 146.05,36.67 146.05,43.66 144.78,44.93 144.78,50.01 JP2.2 | 146.69,56.99 146.69,72.87 145.41,74.14 SERVO2(GRIP).2 | 60.82,51.89 55.54,51.89 54.42,50.77 U2.34 54.42,41.88 51.75,39.21 C2.1 v45.85,37.44 45.85,35.14 | 60.82,51.89 U2.2 | U2.14 60.82,55.89 | 60.82,55.89 60.82,51.89 | 60.82,55.89 U2.7 72.87,55.89 75.88,58.9 | SHIFT1.16 100.33,59.53 v98.42,61.44 86.36,73.5 80.64,73.5 X2.P$5 | STEPPER_DRIVER.10 v85.09,62.07 | U$10.3 23.94,52.55 SW1.2 30.48,51.15 v30.48,50.01 30.48,48.74 33.02,46.2 33.02,41.12 36.82,37.31 R23.2 v41.9,37.31 v41.91,37.31 | C17.1 45.85,35.14
  Bottom 0.254: JP1.2 35.56,56.36 33.02,56.36 30.48,53.82
  Bottom 0.305: 30.48,53.82 v30.48,50.01 | 45.72,37.31 v45.85,37.44
  Bottom 0.406: JP3.2 135.25,60.8 132.72,60.8 131.44,59.53 v131.44,56.36 | U$4.P$1 62.23,85.57 61.59,84.93 41.27,84.93 40.64,85.57 U$3.P$1 | v106.36,46.2 108.9,48.74 v111.76,48.74 | X2.P$5 87.63,84.3 135.89,84.3 140.97,79.22 140.97,74.61 141.45,74.14 SERVO2(GRIP).2 | v41.91,37.31 45.72,37.31 | v85.09,62.07 97.79,62.07 v98.42,61.44
XTAL1
  Top 0.406: Q1.1 124.21,70.33 | 124.21,70.33 C15.1 | U1.17 119.38,66.9 122.81,70.33 124.21,70.33
XTAL2
  Top 0.406: C16.1 124.21,66.52 Q1.2 123.81,65.25 121.92,65.25 120.18,63.51 U1.16

### Text on the board
Top: EDUBOT V0.12 BY / SEBASTIAN MUSZYTOWSKI | USER